# EAGLE design iot_env_mote (EAGLE 7.0.0)

## Sheet 1 of 2
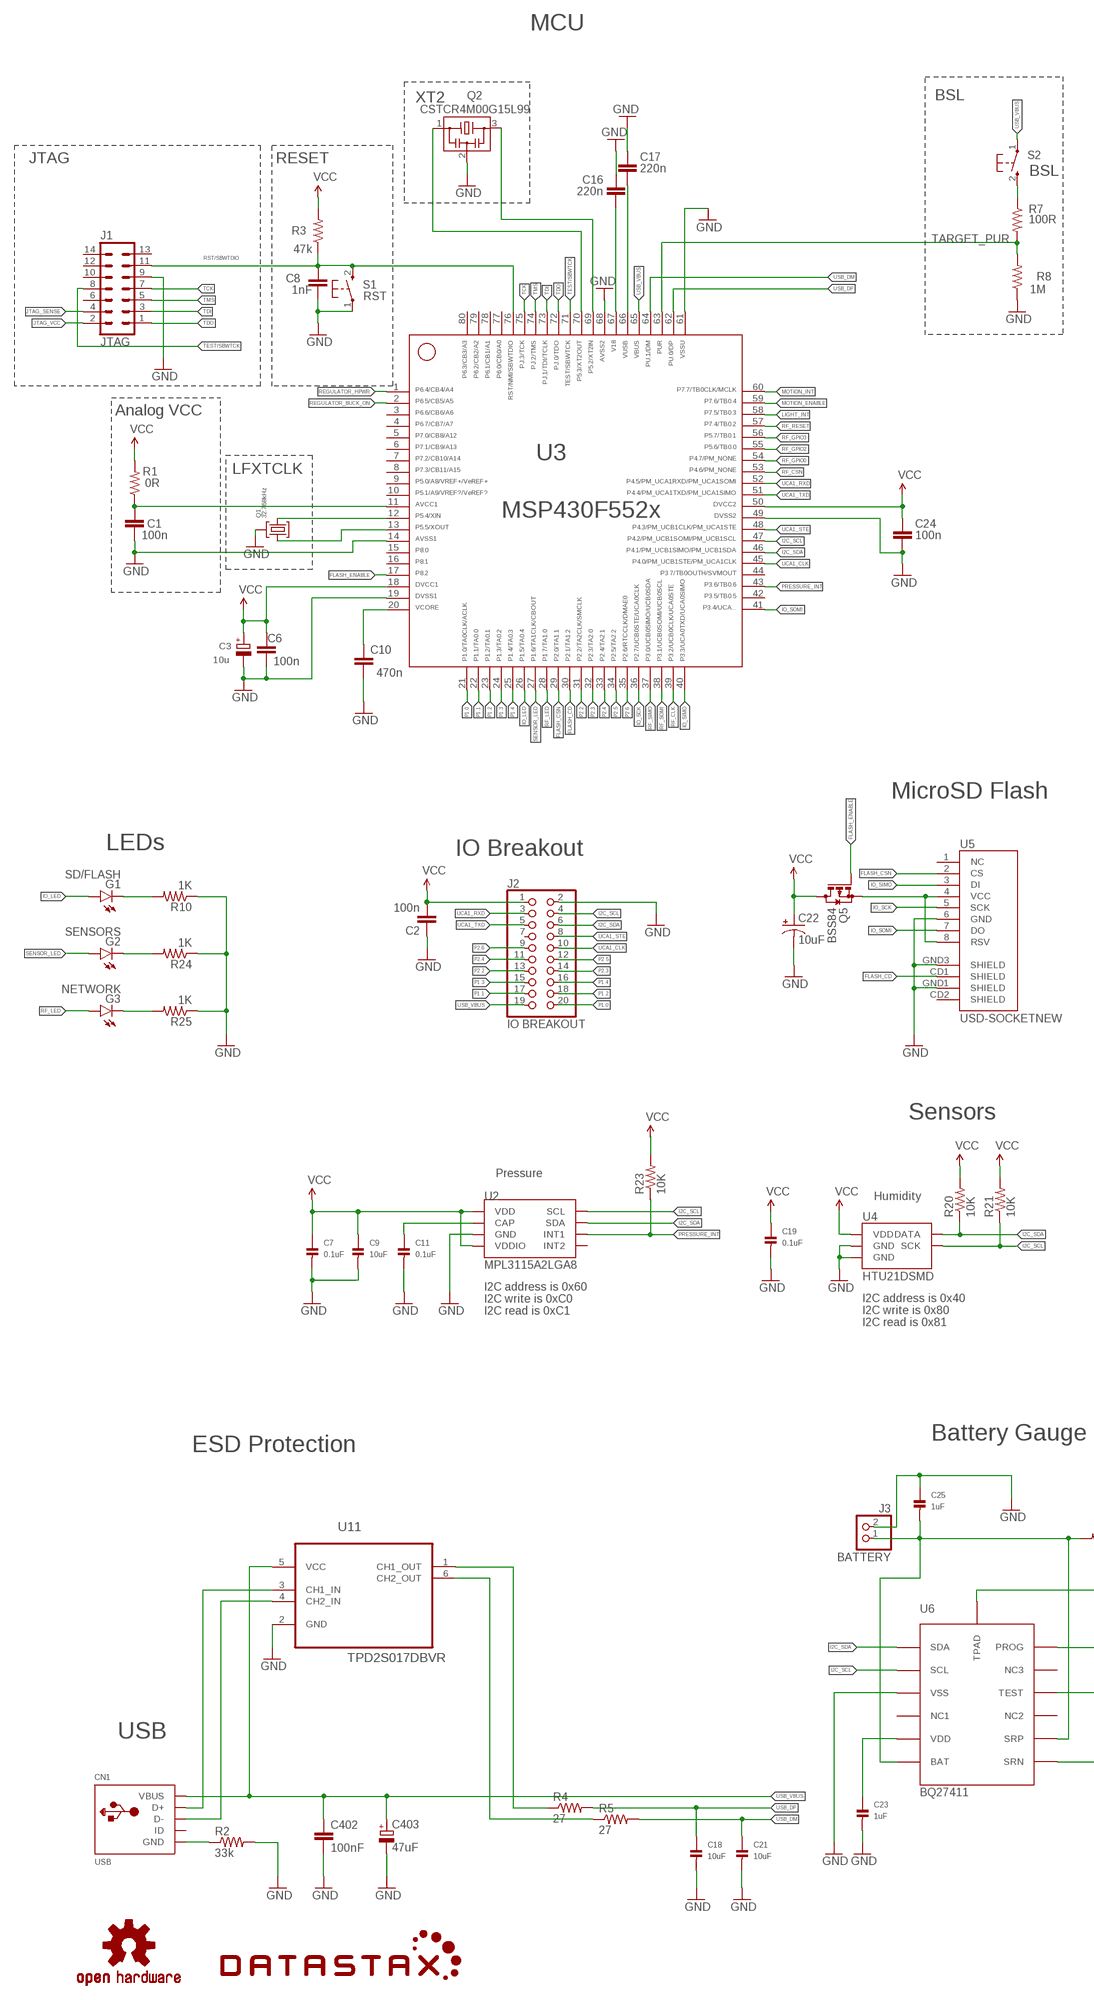
[diagram p0: schematic, sheet 1, part 1 of 2]
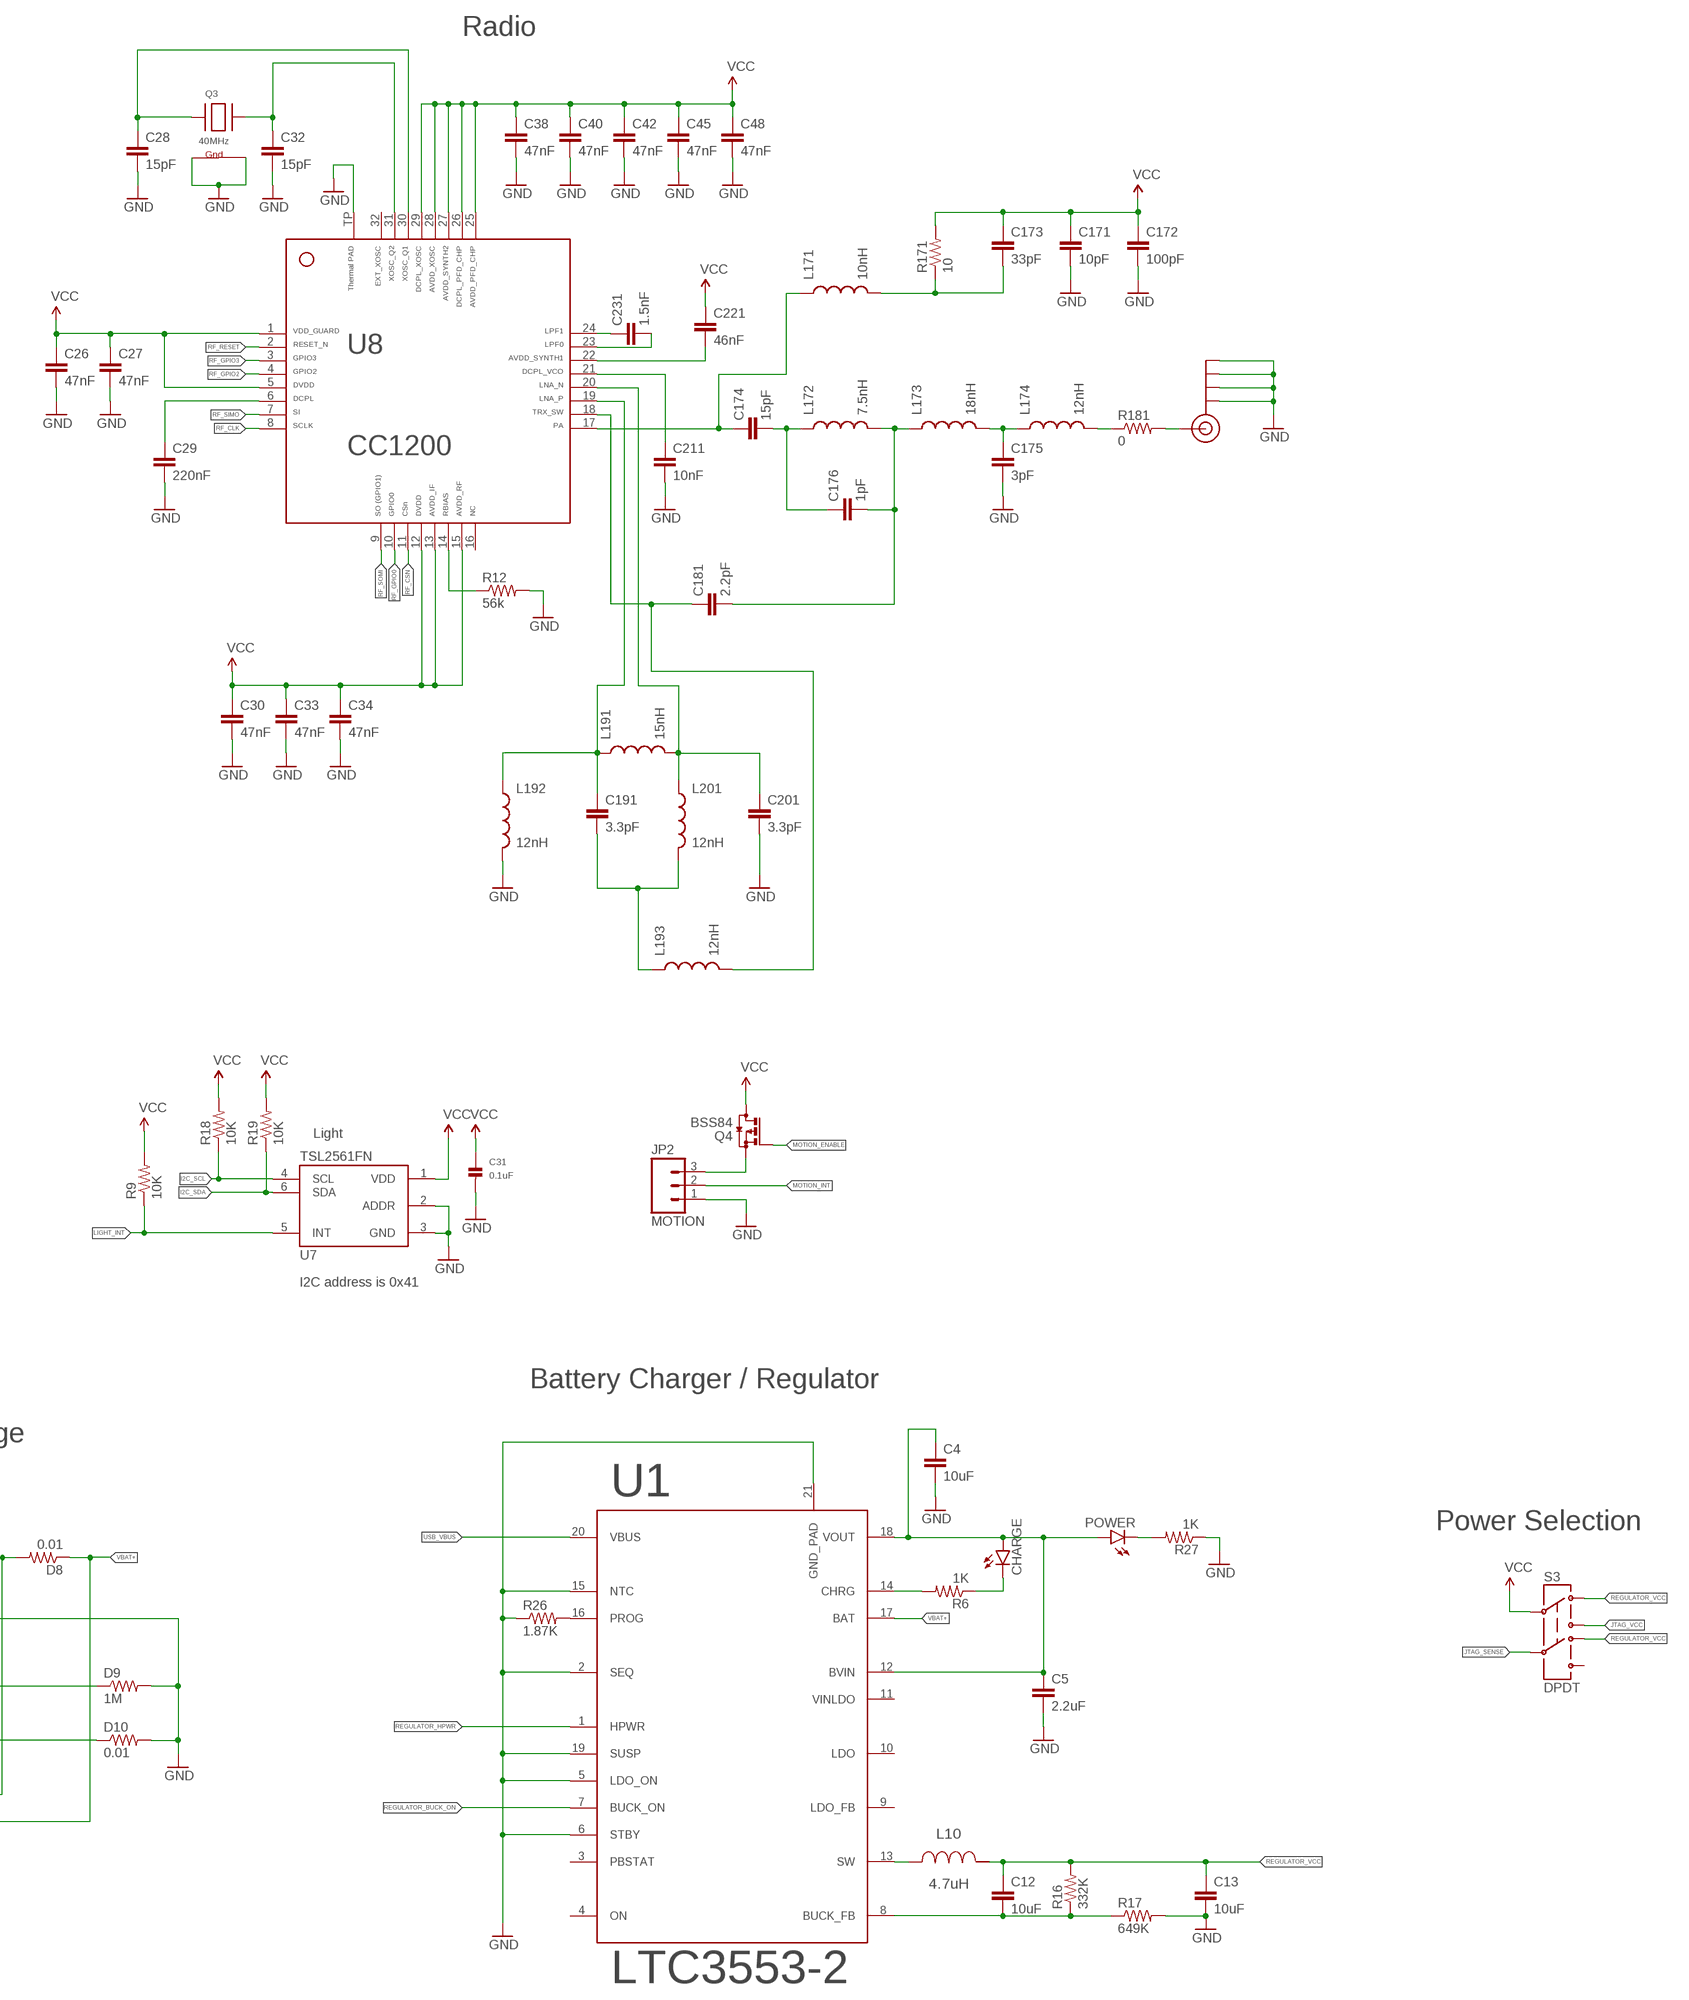
[diagram p1: schematic, sheet 1, part 2 of 2]

### Parts
C1  100n  C-EUC0402  [C0402]
C2  100n  C-EUC0402  [C0402]
C3  10u  CPOL-EUA/3216-18R  [A/3216-18R]
C4  10uF  CAP0805  [0805]
C5  2.2uF  CAP0805  [0805]
C6  100n  C-EUC0402  [C0402]
C7  0.1uF  CAP_CERAMIC0603  [0603]
C8  1nF  C-EUC0402  [C0402]
C9  10uF  CAP_CERAMIC0603  [0603]
C10  470n  C-EUC0402  [C0402]
C11  0.1uF  CAP_CERAMIC0603  [0603]
C12  10uF  CAP0805  [0805]
C13  10uF  CAP0805  [0805]
C16  220n  C-EUC0402  [C0402]
C17  220n  C-EUC0402  [C0402]
C18  10uF  CAP_CERAMIC0603  [0603]
C19  0.1uF  CAP_CERAMIC0603  [0603]
C21  10uF  CAP_CERAMIC0603  [0603]
C22  10uF  CPOL-USA/3216-18R  [A/3216-18R]
C23  1uF  CAP_CERAMIC0603  [0603]
C24  100n  C-EUC0402  [C0402]
C25  1uF  CAP_CERAMIC0603  [0603]
C26  47nF  CAP0402-CAP  [0402-CAP]
C27  47nF  CAP0402-CAP  [0402-CAP]
C28  15pF  CAP0402-CAP  [0402-CAP]
C29  220nF  CAP0402-CAP  [0402-CAP]
C30  47nF  CAP0402-CAP  [0402-CAP]
C31  0.1uF  CAP_CERAMIC0603  [0603]
C32  15pF  CAP0402-CAP  [0402-CAP]
C33  47nF  CAP0402-CAP  [0402-CAP]
C34  47nF  CAP0402-CAP  [0402-CAP]
C38  47nF  CAP0402-CAP  [0402-CAP]
C40  47nF  CAP0402-CAP  [0402-CAP]
C42  47nF  CAP0402-CAP  [0402-CAP]
C45  47nF  CAP0402-CAP  [0402-CAP]
C48  47nF  CAP0402-CAP  [0402-CAP]
C171  10pF  CAP0402-CAP  [0402-CAP]
C172  100pF  CAP0402-CAP  [0402-CAP]
C173  33pF  CAP0402-CAP  [0402-CAP]
C174  15pF  CAP0402-CAP  [0402-CAP]
C175  3pF  CAP0402-CAP  [0402-CAP]
C176  1pF  CAP0402-CAP  [0402-CAP]
C181  2.2pF  CAP0402-CAP  [0402-CAP]
C191  3.3pF  CAP0402-CAP  [0402-CAP]
C201  3.3pF  CAP0402-CAP  [0402-CAP]
C211  10nF  CAP0402-CAP  [0402-CAP]
C221  46nF  CAP0402-CAP  [0402-CAP]
C231  1.5nF  CAP0402-CAP  [0402-CAP]
C402  100nF  C-EUC0402  [C0402]
C403  47uF  CPOL-EUA/3216-18R  [A/3216-18R]
CHARGE  LED0603  [LED-0603]
CN1  USB  USBMINIB  [USB-MINIB]
D8  0.01  R-US_R0402  [R0402]
D9  1M  R-US_R0402  [R0402]
D10  0.01  R-US_R0402  [R0402]
G1  SD/FLASH  LED0603  [LED-0603]
G2  SENSORS  LED0603  [LED-0603]
G3  NETWORK  LED0603  [LED-0603]
J1  JTAG  ML14  [ML14]
J2  IO BREAKOUT  PINHD-2X10  [2X10]
J3  BATTERY  JST_2PIN-SMT-RA  [JST-PH-2-SMT-RA]
JP2  MOTION  M03JST-PTH-VERT  [JST-3-PTH-VERT]
L10  4.7uH  SDR0403-2R2MLSDR0403-2R2ML  [SDR0403]
L171  10nH  INDUCTOR0402  [C0402]
L172  7.5nH  INDUCTOR0402  [C0402]
L173  18nH  INDUCTOR0402  [C0402]
L174  12nH  INDUCTOR0402  [C0402]
L191  15nH  INDUCTOR0402  [C0402]
L192  12nH  INDUCTOR0402  [C0402]
L193  12nH  INDUCTOR0402  [C0402]
L201  12nH  INDUCTOR0402  [C0402]
LOGO1  OSHW-LOGOL  [OSHW-LOGO-L]
POWER  LED0603  [LED-0603]
Q1  32.768kHz  MS3V-T1R  [MS3V-T1R]
Q2  CSTCR4M00G15L99  MURATA-FILTER_CSTCR6M00G53Z  [MURATA-FILTER_CSTCR]
Q3  40MHz  XTAL-4-3225  [NX3225]
Q4  BSS84  [SOT23]
Q5  BSS84  [SOT23]
R1  0R  R-US_R0402  [R0402]
R2  33k  RESISTOR0402-RES  [0402-RES]
R3  47k  R-US_R0402  [R0402]
R4  27  RESISTOR0402-RES  [0402-RES]
R5  27  RESISTOR0402-RES  [0402-RES]
R6  1K  R-US_R0402  [R0402]
R7  100R  R-US_R0402  [R0402]
R8  1M  R-US_R0402  [R0402]
R9  10K  R-US_R0402  [R0402]
R10  1K  RESISTOR0402-RES  [0402-RES]
R12  56k  RESISTOR0402-RES  [0402-RES]
R16  332K  R-US_R0402  [R0402]
R17  649K  R-US_R0402  [R0402]
R18  10K  R-US_R0402  [R0402]
R19  10K  R-US_R0402  [R0402]
R20  10K  R-US_R0402  [R0402]
R21  10K  R-US_R0402  [R0402]
R23  10K  R-US_R0402  [R0402]
R24  1K  RESISTOR0402-RES  [0402-RES]
R25  1K  RESISTOR0402-RES  [0402-RES]
R26  1.87K  R-US_R0402  [R0402]
R27  1K  R-US_R0402  [R0402]
R171  10  RESISTOR0402-RES  [0402-RES]
R181  0  RESISTOR0402-RES  [0402-RES]
S1  RST  PB  [PBTH]
S2  BSL  PB  [PBTH]
S3  DPDT  SWITCH-DPDTAYZ0202  [AYZ0202]
SMA  SMA_EDGE  [SMA-EDGE]
U1  LTC3553-2  [QFN-20-0.4MM]
U2  MPL3115A2LGA8  [LGA8]
U3  MSP430F5529IPNR  F552X---PN80  [PN80]
U4  HTU21DSMD  [HTU21D]
U5  USD-SOCKETNEW  [MICRO-SD-SOCKET-PP]
U6  BQ27411  [VSON40P400X400X12]
U7  TSL2561FN  [FN-6]
U8  CC1200  [RHB32]
U11  TPD2S017DBVR  [SOT95P280X145-6N]
U$1  DATASTAX_LOGO  [DATASTAX_LOGO]

### Nets
AVCC [Power]: C1.1 R1.1 U3.11
BQ27411_BAT [Power]: C25.2 D8.2 J3.1 U6.BAT U6.SRP
FLASH_CD: U3.30 U5.CD1(SHIELD)
FLASH_CSN: U3.29 U5.2(CS)
FLASH_ENABLE: Q5.1(G) U3.17
GND [Ground]: C1.2 C2.1 C3.- C4.2 C5.2 C6.1 C7.2 C8.2 C9.2 C10.1 C11.2 C13.2 C16.2 C17.2 C18.2 C19.2 C21.2 C22.- C23.2 C24.2 C25.1 C26.2 C27.2 C28.2 C29.2 C30.2 C31.2 C32.2 C33.2 C34.2 C38.2 C40.2 C42.2 C45.2 C48.2 C171.2 C172.2 C175.2 C201.2 C211.2 C402.2 C403.- D9.2 D10.2 J1.9 J2.2 J3.2 JP2.1 L192.2 Q1.P3(GND) Q2.2 Q3.2(G2) Q3.4(G1) R2.2 R8.1 R10.1 R12.2 R17.2 R24.1 R25.1 R26.1 R27.1 S1.1(P) SMA.GND@0(GND) SMA.GND@1(GND) SMA.GND@2(GND) SMA.GND@3(GND) U1.2(SEQ) U1.5(LDO_ON) U1.6(STBY) U1.15(NTC) U1.19(SUSP) U1.21(GND_PAD) U2.3(GND) U3.14 U3.19 U3.49 U3.61 U3.68 U4.7(GND) U4.GND U5.6(GND) U5.GND1(SHIELD) U5.GND3(SHIELD) U6.GND(TPAD) U6.VSS U7.2(ADDR) U7.3(GND) U8.TP U11.2(GND)
I2C_SCL: J2.4 R18.1 R21.1 U2.8(SCL) U3.47 U4.SCK U6.SCL U7.4(SCL)
I2C_SDA: J2.6 R19.1 R20.1 U2.7(SDA) U3.46 U4.DATA U6.SDA U7.6(SDA)
IO_LED: G1.A U3.26
IO_SCK: U3.36 U5.5(SCK)
IO_SIMO: U3.40 U5.3(DI)
IO_SOMI: U3.41 U5.7(DO)
JTAG_SENSE: J1.4 S3.5
JTAG_VCC: J1.2 S3.3
LIGHT_INT: R9.1 U3.58 U7.5(INT)
MOTION_ENABLE: Q4.1(G) U3.59
MOTION_INT: JP2.2 U3.60
N$1: C11.1 U2.2(CAP)
N$3 [Power]: JP2.3 Q4.2(S)
N$4: C174.1 L171.1 U8.17
N$7 [Power]: Q5.2(S) U5.4(VCC) U5.8(RSV)
N$9: C231.2 U8.23
N$10: CN1.D+ U11.3(CH1_IN)
N$11: C23.1 U6.VDD
N$12: D10.1 U6.TEST
N$13: C231.1 U8.24
N$14: CN1.D- U11.4(CH2_IN)
N$15: D9.1 U6.PROG
N$16: C211.1 U8.21
N$17: C174.2 C176.1 L172.1
N$18: C29.1 U8.6
N$20: C176.2 C181.2 L172.2 L173.1
N$22: L174.2 R181.1
N$23: C181.1 L193.2 U8.18
N$24: C221.2 U8.22
N$25: R181.2 SMA.SIG(SIGNAL)
N$26: C175.1 L173.2 L174.1
N$27 [Ground]: CN1.GND R2.1
N$28: C173.2 L171.2 R171.1
N$30: C28.1 Q3.1(X1) U8.30
N$31: C191.1 L191.1 L192.1 U8.19
N$32: C201.1 L191.2 L201.1 U8.20
N$33: C32.1 Q3.3(X2) U8.31
N$34: G1.C R10.2
N$35: C191.2 L193.1 L201.2
N$36: L10.2 U1.13(SW)
N$37: R12.1 U8.14
N$38: R7.1 S2.2(S)
N$39: G2.C R24.2
N$41: G3.C R25.2
N$42: R5.1 U11.6(CH2_OUT)
N$43: R4.1 U11.1(CH1_OUT)
N$44: CHARGE.C R6.1
N$45: C4.1 C5.1 CHARGE.A POWER.A U1.12(BVIN) U1.18(VOUT)
N$46: R6.2 U1.14(CHRG)
N$47: POWER.C R27.2
N$49: C12.2 R16.1 R17.1 U1.8(BUCK_FB)
N$50: R26.2 U1.16(PROG)
P1.0: J2.20 U3.21
P1.1: J2.17 U3.22
P1.2: J2.18 U3.23
P1.3: J2.15 U3.24
P1.4: J2.16 U3.25
P2.2: J2.13 U3.31
P2.3: J2.14 U3.32
P2.4: J2.11 U3.33
P2.5: J2.12 U3.34
P2.6: J2.9 U3.35
P5.2/XT2IN: Q2.3 U3.69
P5.3/XT2OUT: Q2.1 U3.70
P5.4/XIN: Q1.P2 U3.12
P5.5/XOUT: Q1.P1 U3.13
PRESSURE_INT: R23.1 U2.6(INT1) U3.43
REGULATOR_BUCK_ON: U1.7(BUCK_ON) U3.2
REGULATOR_HPWR: U1.1(HPWR) U3.1
REGULATOR_VCC: C12.1 C13.1 L10.1 R16.2 S3.1 S3.4
RF_CLK: U3.39 U8.8
RF_CSN: U3.53 U8.11
RF_GPIO0: U3.54 U8.10
RF_GPIO2: U3.55 U8.4
RF_GPIO3: U3.56 U8.3
RF_LED: G3.A U3.28
RF_RESET: U3.57 U8.2
RF_SIMO: U3.37 U8.7
RF_SOMI: U3.38 U8.9
RST/SBWTDIO: C8.1 J1.11 R3.1 S1.2(S) U3.76
SENSOR_LED: G2.A U3.27
TARGET_PUR: R7.2 R8.2 U3.63
TARGET_VUSB [Power]: C17.1 U3.66
TCK: J1.7 U3.75
TDI: J1.3 U3.73
TDO: J1.1 U3.72
TEST/SBWTCK: J1.8 U3.71
TMS: J1.5 U3.74
UCA1_CLK: J2.10 U3.45
UCA1_RXD: J2.3 U3.52
UCA1_STE: J2.8 U3.48
UCA1_TXD: J2.5 U3.51
USB_DM: C21.1 R5.2 U3.64
USB_DP: C18.1 R4.2 U3.62
USB_VBUS: C402.1 C403.+ CN1.VBUS J2.19 S2.1(P) U1.20(VBUS) U3.65 U11.5(VCC)
V18 [Power]: C16.1 U3.67
VBAT+: D8.1 U1.17(BAT) U6.SRN
VCC [Power]: C2.2 C3.+ C6.2 C7.1 C9.1 C19.1 C22.+ C24.1 C26.1 C27.1 C30.1 C31.1 C33.1 C34.1 C38.1 C40.1 C42.1 C45.1 C48.1 C171.1 C172.1 C173.1 C221.1 J2.1 Q4.3(D) Q5.3(D) R1.2 R3.2 R9.2 R18.2 R19.2 R20.2 R21.2 R23.2 R171.2 S3.2 U2.1(VDD) U2.4(VDDIO) U3.18 U3.50 U4.VDD U7.1(VDD) U8.1 U8.5 U8.12 U8.13 U8.15 U8.25 U8.26 U8.27 U8.28 U8.29
VCORE [Power]: C10.2 U3.20
Unconnected: CN1.ID J1.6 J1.10 J1.12 J1.13 J1.14 J2.7 S3.6 U1.3(PBSTAT) U1.4(ON) U2.5(INT2) U3.3 U3.4 U3.5 U3.6 U3.7 U3.8 U3.9 U3.10 U3.15 U3.16 U3.42 U3.44 U3.77 U3.78 U3.79 U3.80 U5.1(NC) U5.CD2(SHIELD) U6.NC1 U6.NC2(NC3) U6.NC3(NC2) U8.16 U8.32

### Notes on the sheet
- MCU
- XT2 | BSL
- JTAG | RESET
- Radio
- Analog VCC
- /Users/mstump/Downloads/datastax_logo_black.bmp
- LFXTCLK
- MicroSD Flash
- LEDs | IO Breakout
- Sensors
- Pressure
- Light
- Humidity
- I2C address is 0x41
- I2C address is 0x60
  I2C write is 0xC0
  I2C read is 0xC1
- I2C address is 0x40
  I2C write is 0x80
  I2C read is 0x81
- Battery Charger / Regulator
- Battery Gauge
- ESD Protection
- Power Selection
- USB

## Sheet 2 of 2

## Power pins joined to a net without a drawn wire
LDO: U1.10(LDO)
LDO_FB: U1.9(LDO_FB)
VINLDO: U1.11(VINLDO)

## Library data of the parts
C1 C2 C6 C8 C10 C16 C17 C24 C402 = rcl:C-EU: CAPACITOR, European symbol
C3 C403 = rcl:CPOL-EU: POLARIZED CAPACITOR, European symbol
C4 C5 C12 C13 = SparkFun-Capacitors:CAP: Capacitor Standard 0603 ceramic capacitor, and 0.1" leaded capacitor.; MPN: 06035A100FAT2A; OC_NEWARK: 43T7237
C7 C11 C19 C31 = microbuilder:CAP_CERAMIC: Ceramic Capacitors 0402 - 0402 Surface Mount Capacitors 16pF 50V 5% [Digikey: 445-4899-2-ND] 18pF 50V 5% [Digikey: 490-1281-2-ND] 22pF 50V 5% [Digikey: 490-1283-2-ND] 68pF 50V 5% [Digikey: 490-1289-2-ND] 0.1uF 10V 10% [Digikey: 490-1318-2-ND] 1.0uF 6.3V 10% [Digikey: 490-1320-2-ND] 0603 - 0603 Surface Mount Capacitors 16 pF 50V 5% [Digikey: 445-5051-2-ND] 22 pF 50V [Digikey: PCC220ACVTR-ND] 33 pF 50V 5% [Digikey: 490-1415-1-ND] 56pF 50V 5% [Digikey: 490-1421-1-ND] 220pF 50V 5% [Digikey: 445-1285-1-ND] 680 pF 50V 2200 pF 50V 5% C0G [Digikey: 445-1297-1-ND] 5600 pF 100V 5% X7R [Digikey: 478-3711-1-ND] 0.1 µF 25V 10% [Digikey: PCC2277TR-ND] 0.22 µF 16V 10% X7R [Digikey: 445-1318-1-ND] 1.0 µF 25V 10% [Digikey: 445-5146-2-ND] 0603 - RF Specific 3pF 250V +/-0.1pF RF [Digikey: 712-1347-1-ND] 18 pF 250V 5% [Digikey: 478-3505-1-ND or 712-1322-1-ND] 56 pF 250V 5% C0G RF [Digikey: 490-4867-1-ND] 68 pF 250V RF [Digikey: 490-4868-1-ND] 0805 - 0805 Surface Mount Capacitors 220 pF 250V 2% RF Ceramic Capacitor [Digikey: 712-1398-1-ND] 1000 pF 50V 2% NP0 Ceramic Capacitor [Digikey: 478-3760-1-ND] 0.1 µF 25V 10% Ceramic Capacitor [Digikey: PCC1828TR-ND] 1.0 µF 16V 10% Ceramic Capacitor[Digikey: 490-1691-2-ND] 10.0 µF 10V 10% Ceramic Capacitor[Digikey: 709-1228-1-ND] 10.0 uF 16V 10% Ceramic Capacitor [Digikey: 478-5165-2-ND] 47 uF 6.3V 20% Ceramic Capacitor [Digikey: 587-1779-1-ND or 399-5506-1-ND] 1206 - 1206 Surface Mount Capacitors 47uF 10V 20% Ceramic Capacitor [Digikey: 490-5528-1-ND or 399-5508-1-ND or 445-6010-1-ND] 100uF 6.3V -20%, +80% Y5V Ceramic Capacitor (Digikey: 490-4512-1-ND, Mouser: 81-GRM31CF50J107ZE1L); MPN: 0603YC104JAT2A; OC_NEWARK: 96M1175
C9 C18 C21 C23 C25 = microbuilder:CAP_CERAMIC: Ceramic Capacitors 0402 - 0402 Surface Mount Capacitors 16pF 50V 5% [Digikey: 445-4899-2-ND] 18pF 50V 5% [Digikey: 490-1281-2-ND] 22pF 50V 5% [Digikey: 490-1283-2-ND] 68pF 50V 5% [Digikey: 490-1289-2-ND] 0.1uF 10V 10% [Digikey: 490-1318-2-ND] 1.0uF 6.3V 10% [Digikey: 490-1320-2-ND] 0603 - 0603 Surface Mount Capacitors 16 pF 50V 5% [Digikey: 445-5051-2-ND] 22 pF 50V [Digikey: PCC220ACVTR-ND] 33 pF 50V 5% [Digikey: 490-1415-1-ND] 56pF 50V 5% [Digikey: 490-1421-1-ND] 220pF 50V 5% [Digikey: 445-1285-1-ND] 680 pF 50V 2200 pF 50V 5% C0G [Digikey: 445-1297-1-ND] 5600 pF 100V 5% X7R [Digikey: 478-3711-1-ND] 0.1 µF 25V 10% [Digikey: PCC2277TR-ND] 0.22 µF 16V 10% X7R [Digikey: 445-1318-1-ND] 1.0 µF 25V 10% [Digikey: 445-5146-2-ND] 0603 - RF Specific 3pF 250V +/-0.1pF RF [Digikey: 712-1347-1-ND] 18 pF 250V 5% [Digikey: 478-3505-1-ND or 712-1322-1-ND] 56 pF 250V 5% C0G RF [Digikey: 490-4867-1-ND] 68 pF 250V RF [Digikey: 490-4868-1-ND] 0805 - 0805 Surface Mount Capacitors 220 pF 250V 2% RF Ceramic Capacitor [Digikey: 712-1398-1-ND] 1000 pF 50V 2% NP0 Ceramic Capacitor [Digikey: 478-3760-1-ND] 0.1 µF 25V 10% Ceramic Capacitor [Digikey: PCC1828TR-ND] 1.0 µF 16V 10% Ceramic Capacitor[Digikey: 490-1691-2-ND] 10.0 µF 10V 10% Ceramic Capacitor[Digikey: 709-1228-1-ND] 10.0 uF 16V 10% Ceramic Capacitor [Digikey: 478-5165-2-ND] 47 uF 6.3V 20% Ceramic Capacitor [Digikey: 587-1779-1-ND or 399-5506-1-ND] 1206 - 1206 Surface Mount Capacitors 47uF 10V 20% Ceramic Capacitor [Digikey: 490-5528-1-ND or 399-5508-1-ND or 445-6010-1-ND] 100uF 6.3V -20%, +80% Y5V Ceramic Capacitor (Digikey: 490-4512-1-ND, Mouser: 81-GRM31CF50J107ZE1L); MPN: 06035A100FAT2A; OC_NEWARK: 43T7237
C22 = adafruit:CPOL-US: POLARIZED CAPACITOR, American symbol
C26-C30 C32-C34 C38 C40 C42 C45 C48 C171-C176 C181 C191 C201 C211 C221 C231 = SparkFun-Capacitors:CAP: Capacitor Standard 0603 ceramic capacitor, and 0.1" leaded capacitor.; MPN: 0603YC104JAT2A; OC_NEWARK: 96M1175
CHARGE G1-G3 POWER = SparkFun-LED:LED: LEDs Standard schematic elements and footprints for 5mm, 3mm, 1206, and 0603 sized LEDs. 5mm - Spark Fun Electronics SKU : COM-00529 (and others)
CN1 = adafruit:USB: USB Connectors USBMINIB - Surface Mount Female Mini-B USB Connector 4UConnector: 06564 By microbuilder.eu Thru-hole RA Female Mini-B USB Connector 4UConnector: 18732 By ladyada.net
D8-D10 R1 R3 R6-R8 R16 R17 R26 R27 = adafruit:R-US_: RESISTOR, American symbol
J1 = CON-ML:ML14: HARTING; OC_FARNELL: unknown; OC_NEWARK: unknown
J2 = pinhead:PINHD-2X10: PIN HEADER
J3 = adafruit:JST_2PIN: JST 2-Pin Connectors of various flavors SMT-RA (S2B-PH-SM4) 4UConnector #17311 SMT (B2B-PH-SM4) THM-RA (S2B-PH) THM (B2B-PH)
JP2 = SparkFun-Connectors:M03: Header 3 Standard 3-pin 0.1" header. Use with straight break away headers (SKU : PRT-00116), right angle break away headers (PRT-00553), swiss pins (PRT-00743), machine pins (PRT-00117), and female headers (PRT-00115). Molex polarized connector foot print use with SKU : PRT-08232 with associated crimp pins and housings.
L10 = AcceleratedDesigns_Lib:SDR0403-2R2ML; DCR: 0.047; IDC: 2.6; L: 2.2E-6; MANUFACTURER_NAME: Bourns; MANUFACTURER_PART_NUMBER: SDR0403-2R2ML; VENDOR: Bourns
L171-L174 L191-L193 L201 = SparkFun-Passives:INDUCTOR: Inductors Basic Inductor/Choke - 0603 and 1206. Footprints are not proven and vary greatly between part numbers. SRN6045- 33uH, 20% 1.4A SDR0403-560KL - 56uH, 10%, 500mA RMS/740mA peak
LOGO1 = SparkFun-Aesthetics:OSHW-LOGO: Open Source Hardware Logo This logo indicates the piece of hardware it is found on incorporates a OSHW license and/or adheres to the definition of open source hardware found here: http://freedomdefined.org/OSHW; OC_NEWARK: unknown
Q1 = microcrystal:MS3V-T1R
Q2 = murata:MURATA-FILTER_CSTCR: Resonator Source: murata.co.jp; MPN: CSTCR6M00G53-R0; OC_FARNELL: 1170434; OC_NEWARK: 25M8759
Q3 = adafruit:XTAL-4: Classic 4-pin 3.2 x 2.5mm crystal
Q4 Q5 = transistor-small-signal:BSS84: P-CHANNEL MOS FET
R2 R4 R5 R10 R12 R24 R25 R171 R181 = SparkFun-Passives:RESISTOR: Resistor Basic schematic elements and footprints for 0603, 1206, and PTH resistors.
R9 R18-R21 R23 = adafruit:R-US_: RESISTOR, American symbol; MPN: ERJ-P03F1002V; OC_NEWARK: 32R9341
S1 S2 = electricalmeter:PB: OMRON SWITCH
S3 = SparkFun-Electromechanical:SWITCH-DPDT: DPDT Version of the COM-00597; PROD_ID: SWCH-08179
SMA = SparkFun-Connectors:SMA_EDGE: SMA Antenna Connector End launch SMA connector. The paste layer has been removed so that the connector can be hand soldered onto the board after reflow.
U1 = iot_demo_hardware:LTC3553-2
U2 = SparkFun-Sensors:MPL3115A2: Altimeter/Pressure Sensor, I2C, 1.95V-3.6V supply, 50 to 110kPa; MPN: MPL3115A2; OC_NEWARK: 48T4344
U3 = TI_MSP430_v16_intern:F552X---PN80: ***MSP430F552X***PN80 http://www.ti.com/lit/gpn/msp430f5529 Rev1.0 06/2010 For F552X where X is 1,5,7,9
U4 = SparkFun-Sensors:HTU21D; MPN: HTU21D; OC_NEWARK: 37X5938
U5 = SparkFun-Connectors:USD-SOCKET: microSD Socket Push-push type uSD socket. Schematic element and footprint production proven. Spark Fun Electronics SKU : PRT-00127. tDoc lines correctly indicate media card edge positions when inserting (unlocked, locked, depressed).
U6 = iot_demo_hardware:BQ27411
U7 = mike-temp:TSL2561: TSL2561 illumination sensor Approximates Human Eye Response Precisely Measures Illuminance Programmable Interrupt Function with User-Defined Upper and Lower Threshold 400 KHz I2C interface Programmable Analog Gain and Integration Time Supporting 1,000,000-to-1 Dynamic Range Automatically Rejects 50/60-Hz Lighting Ripple Low Active Power (0.75 mW Typical) with Power Down Mode RoHS Compliant The TSL2561 is a light-to-digital converter that transform light intensity to a digital signal output via I2C interface. The device combines one broadband photodiode (visible plus infrared) and one infrared-responding photodiode on a single CMOS integrated circuit capable of providing a near-photopic response over an effective 20-bit dynamic range (16-bit resolution). Two integrating ADCs convert the photodiode currents to a digital output that represents the irradiance measured on each channel. This digital output can be input to a microprocessor where illuminance (ambient light level) in lux is derived using an empirical formula to approximate the human eye response. The TSL2561 device supports a traditional level style interrupt that remains asserted until the firmware clears it.; MPN: TSL2561T; OC_NEWARK: 05M1632
U8 = iot_demo_hardware:CC1200: CC1200
U11 = Texas Instruments_By_element14_Batch_1:TPD2S017DBVR: 2-CHANNEL ULTRA-LOW CLAMP VOLTAGE ESD SOLUTION WITH SERIES-RESISTOR ISOLATION; MPN: TPD2S017DBVR; OC_FARNELL: -; OC_NEWARK: 50R8094; PACKAGE: SOT-23-6; SUPPLIER: Texas Instruments
U$1 = datastax:DATASTAX_LOGO

## Net classes
1 Ground: width 0.203 mm, drill 0.305 mm, clearance 0.152 mm to class 0, clearance 0.152 mm
2 Power: width 0.203 mm, drill 0.305 mm, clearance 0.152 mm to class 0, clearance 0.152 mm to class 1, clearance 0.152 mm

## Board
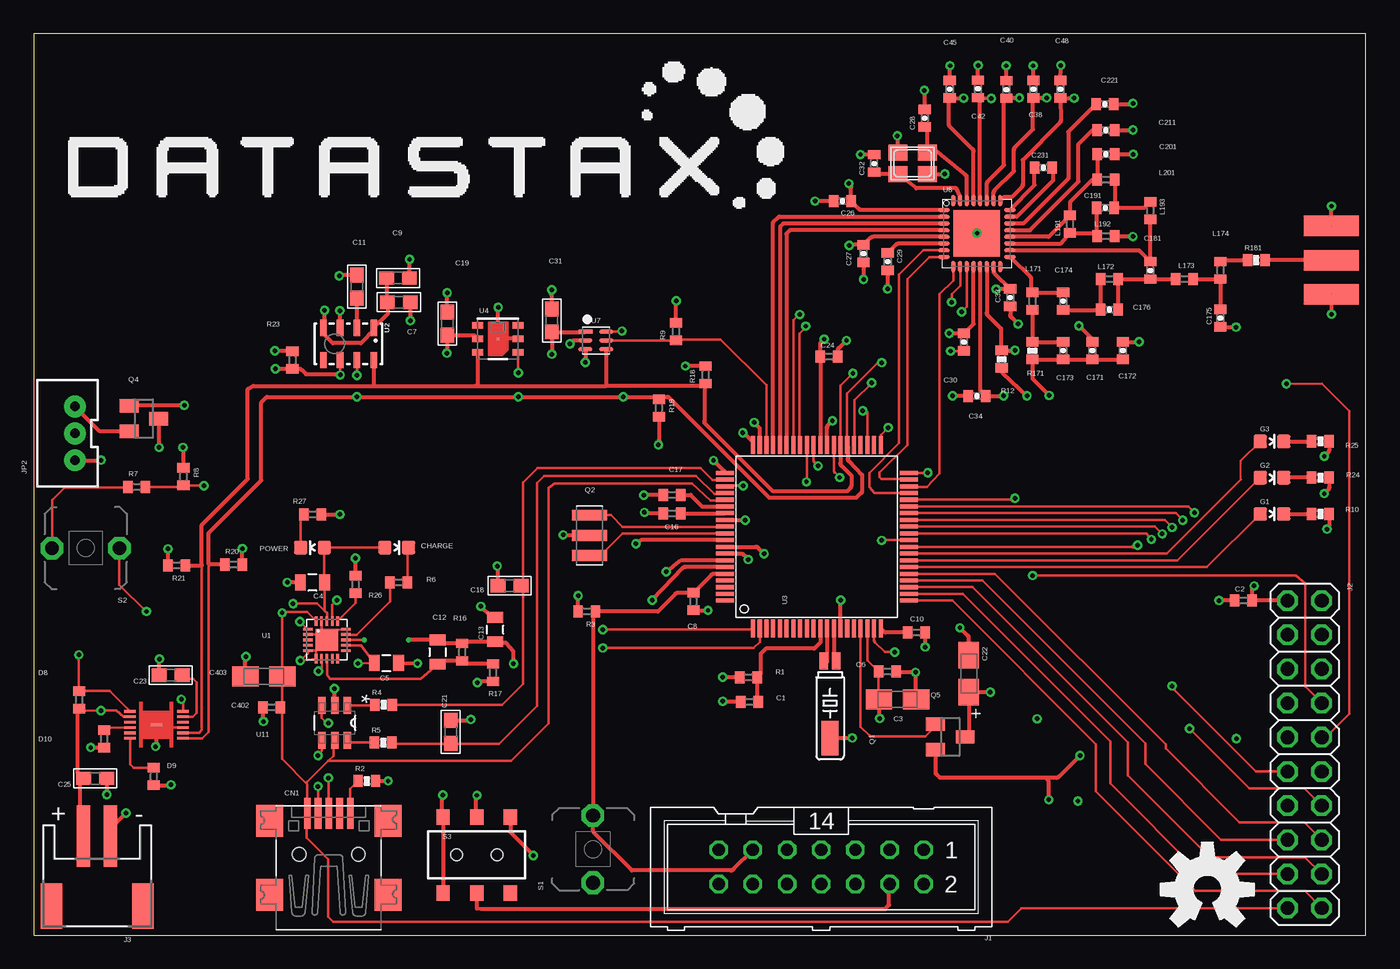
[diagram p2: board, top side]
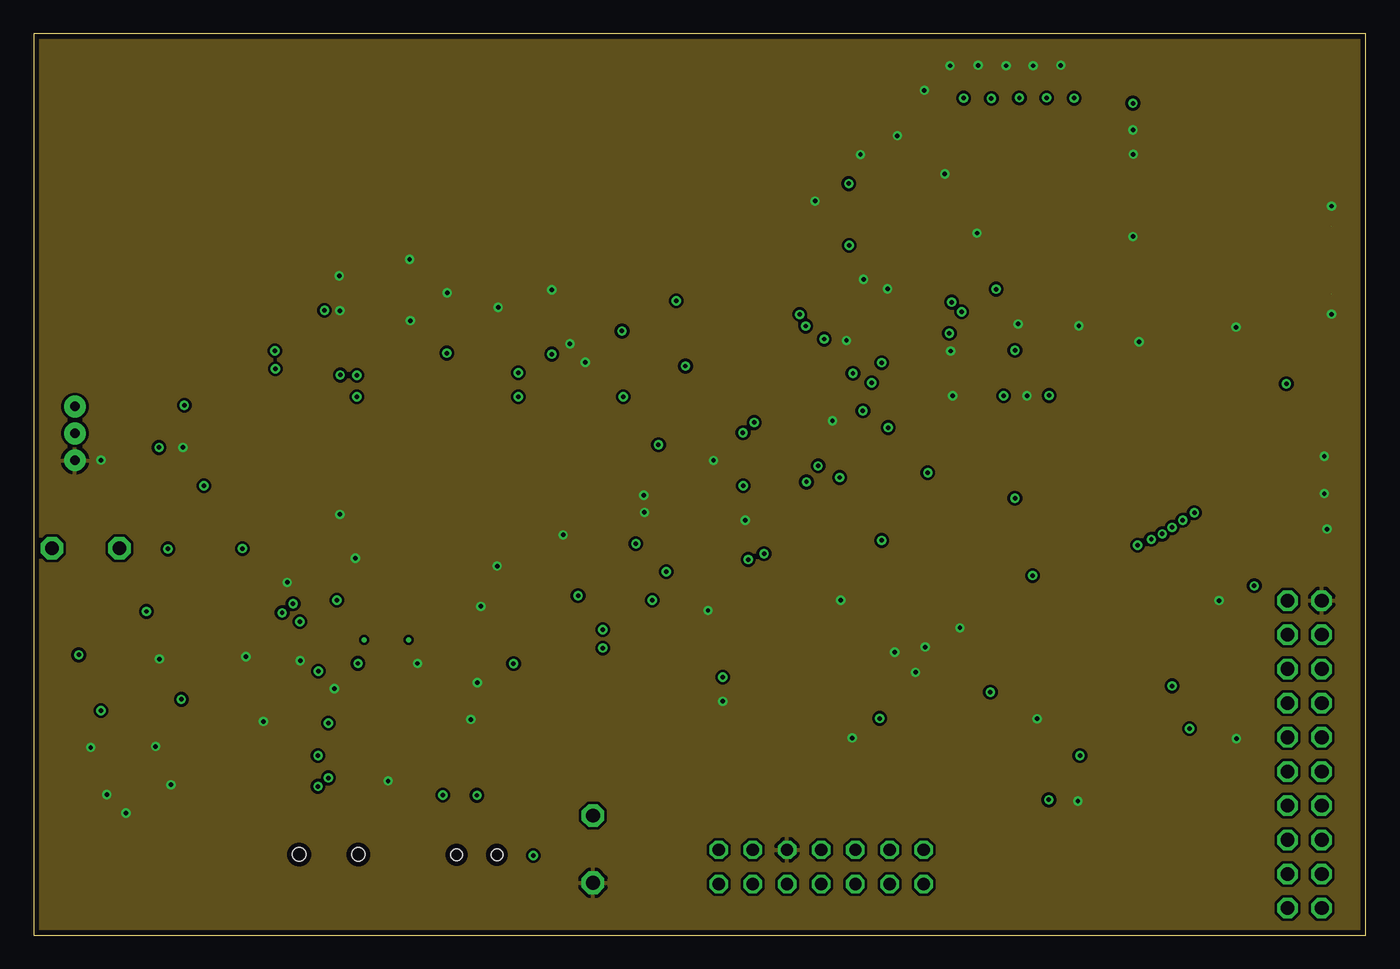
[diagram p3: board, inner layer Route2]
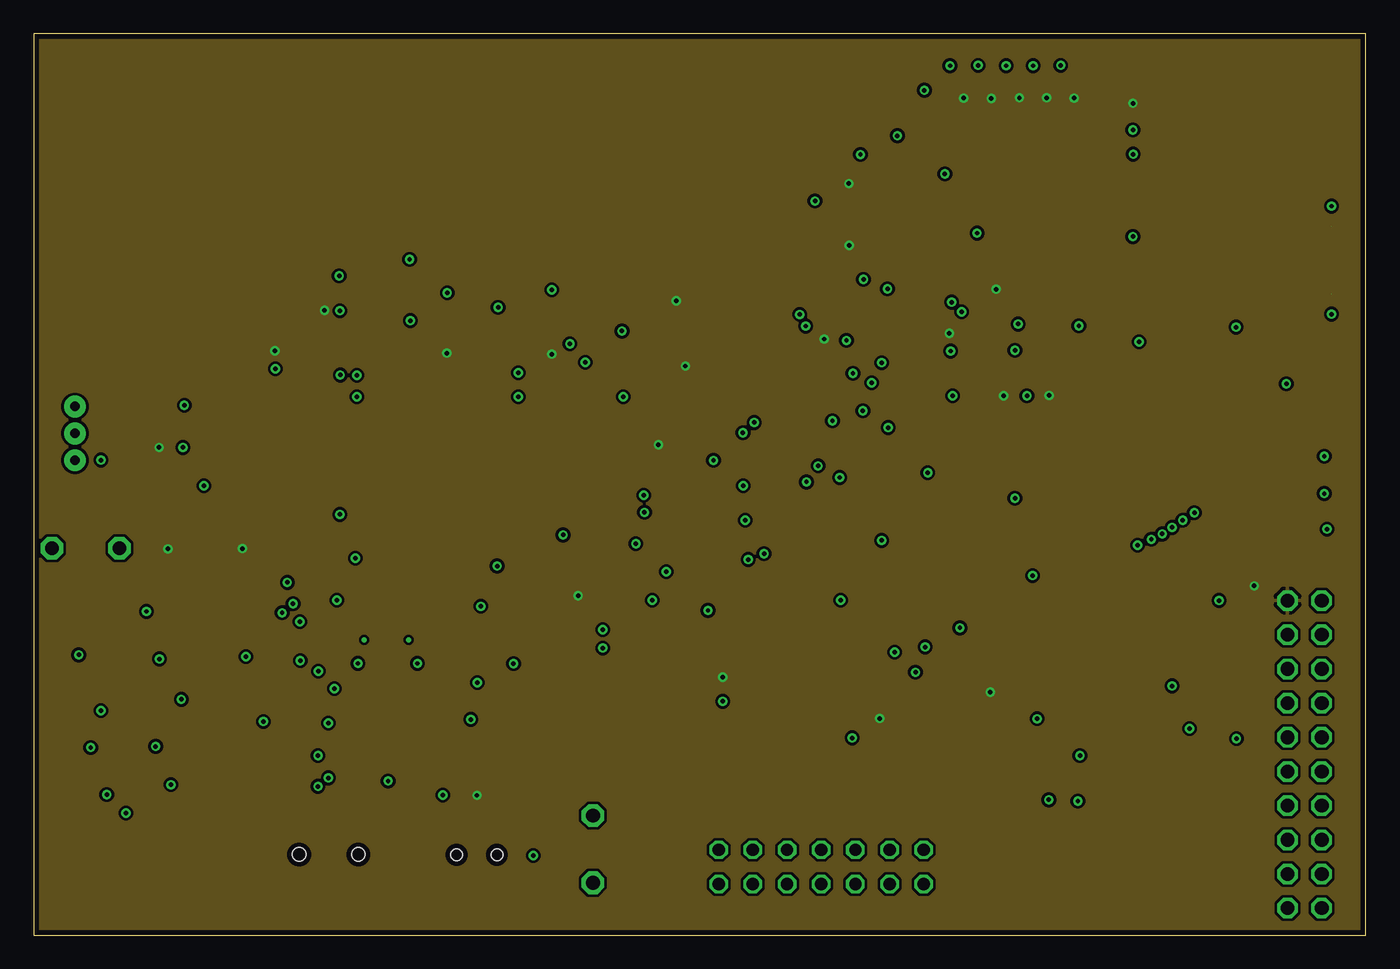
[diagram p4: board, inner layer Route15]
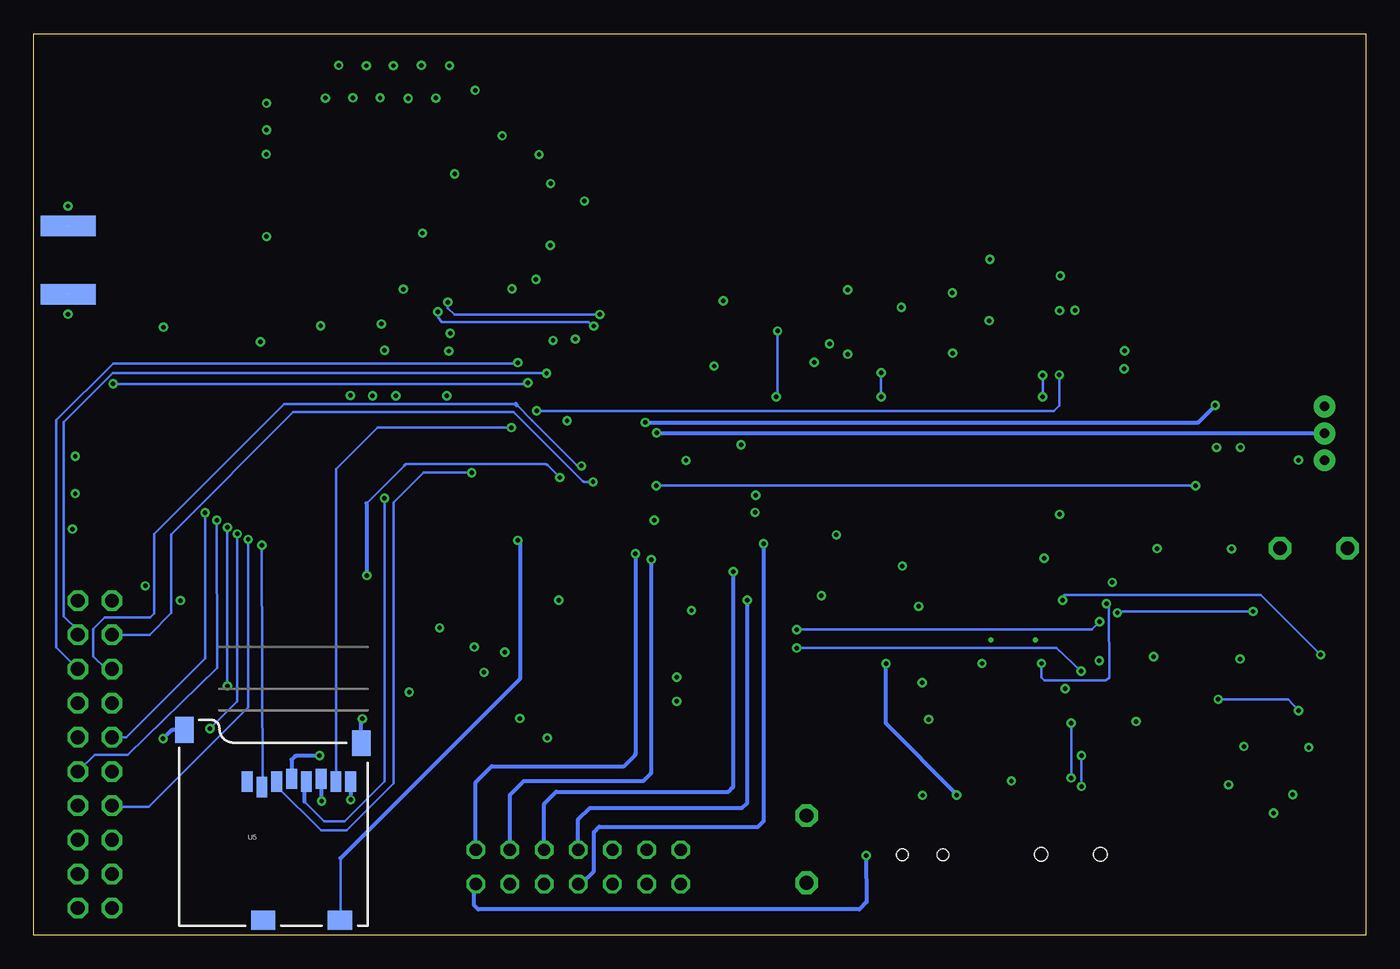
[diagram p5: board, bottom side, seen from below]

Size 99 x 67 mm. Coordinates in mm from the lower left corner, seen from the top.
Outline: 0.02,0 99,0 99,67 0,67 0.02,0
Copper layers (1*2+15*16): Top 0.0356mm / dielectric 1.5011mm / Route2 0.0356mm / dielectric 0.1499mm / Route15 0.0356mm / dielectric 0.2007mm / Bottom 0.0356mm
Design rules "LaenPCBOrder *": minimum track width 6mil, minimum drill 13mil, track to track 6mil, track to pad 6mil, pad to pad 6mil, via to via 6mil, smd to smd 6mil, copper to edge 15mil, drill to drill 6mil, minimum pad ring 7mil, minimum via ring 7mil, stop-mask expansion 3mil, vias tented up to drill 0mil, thermal gap 10mil

### Footprints (pad centres in the part's own frame; a part is rotated, then mirrored left to right if it is on the bottom)
C0402 = smd 0.7 x 0.9: 1 -0.65,0; 2 0.65,0
A/3216-18R = smd 1.95 x 1.5: + 1.375,0; - -1.375,0
0805 = smd 0.8 x 1.2: 1 -0.9,0; 2 0.9,0
0603 = smd 1.1 x 1: 1 -0.85,0; 2 0.85,0
0402-CAP = smd 0.7 x 0.9: 1 -0.65,0; 2 0.65,0
LED-0603 = smd 1 x 1: A 0,-0.877; C 0,0.877
USB-MINIB = smd 0.5 x 2.308: D+ 0,4.064; D- -0.8,4.064; GND 1.6,4.064; ID 0.8,4.064; VBUS -1.6,4.064 | smd 2 x 2.4: GND1 -4.4,-2; GND2 -4.4,3.5; GND3 4.4,3.5; GND4 4.4,-2 | hole 1: -2.2,1; 2.2,1
R0402 = smd 0.7 x 0.9: 1 -0.65,0; 2 0.65,0
ML14 = drill 0.914 octagon: 1 -7.62,-1.27; 2 -7.62,1.27; 3 -5.08,-1.27; 4 -5.08,1.27; 5 -2.54,-1.27; 6 -2.54,1.27; 7 0,-1.27; 8 0,1.27; 9 2.54,-1.27; 10 2.54,1.27; 11 5.08,-1.27; 12 5.08,1.27; 13 7.62,-1.27; 14 7.62,1.27
2X10 = drill 1.016 octagon: 1 -11.43,-1.27; 2 -11.43,1.27; 3 -8.89,-1.27; 4 -8.89,1.27; 5 -6.35,-1.27; 6 -6.35,1.27; 7 -3.81,-1.27; 8 -3.81,1.27; 9 -1.27,-1.27; 10 -1.27,1.27; 11 1.27,-1.27; 12 1.27,1.27; 13 3.81,-1.27; 14 3.81,1.27; 15 6.35,-1.27; 16 6.35,1.27; 17 8.89,-1.27; 18 8.89,1.27; 19 11.43,-1.27; 20 11.43,1.27
JST-PH-2-SMT-RA = smd 1 x 4.6: 1 1,-3.7; 2 -1,-3.7 | smd 1.6 x 3.4: NC1 -3.4,1.5; NC2 3.4,1.5
JST-3-PTH-VERT = drill 0.7 pad 1.626: 1 -2,-0.55; 2 0,-0.55; 3 2,-0.55
SDR0403 = drill 0: 1 -1.651,0; 2 1.651,0
MS3V-T1R = smd 0.635 x 1.27: P1 -0.47,-4.43; P2 0.47,-4.43 | smd 1.27 x 2.54: P3 0,1.3
MURATA-FILTER_CSTCR = smd 0.8 x 2.6: 1 -1.5,0; 2 0,0; 3 1.5,0
NX3225 = smd 1.4 x 1.2: 1 -1.1,-0.8; 2 1.1,-0.8; 3 1.1,0.8; 4 -1.1,0.8
SOT23 = smd 1 x 1.4: 1 -0.95,-1.1; 2 0.95,-1.1; 3 0,1.1
0402-RES = smd 0.7 x 0.9: 1 -0.65,0; 2 0.65,0
PBTH = drill 1.016 pad 1.676 octagon: 1 -0.001,0.001; 2 5.001,0.001
AYZ0202 = smd 1 x 1.15: 1 -2.5,2.825; 2 0,2.825; 3 2.5,2.825; 4 -2.5,-2.825; 5 0,-2.825; 6 2.5,-2.825 | hole 0.85: 1.5,0; -1.5,0
SMA-EDGE = smd 1.524 x 4.064: GND@0 0,0; GND@1 5.08,0; SIG 2.54,0 | smd 1.524 x 4.064 bottom: GND@2 0,0; GND@3 5.08,0
QFN-20-0.4MM = smd 0.7 x 0.2: 1 -1.4,0.8; 2 -1.4,0.4; 3 -1.4,0; 4 -1.4,-0.4; 5 -1.4,-0.8; 11 1.4,-0.8; 12 1.4,-0.4; 13 1.4,0; 14 1.4,0.4; 15 1.4,0.8 | smd 0.2 x 0.7: 6 -0.8,-1.4; 7 -0.4,-1.4; 8 0,-1.4; 9 0.4,-1.4; 10 0.8,-1.4; 16 0.8,1.4; 17 0.4,1.4; 18 0,1.4; 19 -0.4,1.4; 20 -0.8,1.4 | smd 1.65 x 1.65: 21 0,0
LGA8 = smd 1.2 x 0.5: 1 -1.2,1.875; 2 -1.2,0.625; 3 -1.2,-0.625; 4 -1.2,-1.875; 5 1.2,-1.875; 6 1.2,-0.625; 7 1.2,0.625; 8 1.2,1.875
PN80 = smd 1.35 x 0.3: 1 -6.825,4.75; 2 -6.825,4.25; 3 -6.825,3.75; 4 -6.825,3.25; 5 -6.825,2.75; 6 -6.825,2.25; 7 -6.825,1.75; 8 -6.825,1.25; 9 -6.825,0.75; 10 -6.825,0.25; 11 -6.825,-0.25; 12 -6.825,-0.75; 13 -6.825,-1.25; 14 -6.825,-1.75; 15 -6.825,-2.25; 16 -6.825,-2.75; 17 -6.825,-3.25; 18 -6.825,-3.75; 19 -6.825,-4.25; 20 -6.825,-4.75; 41 6.825,-4.75; 42 6.825,-4.25; 43 6.825,-3.75; 44 6.825,-3.25; 45 6.825,-2.75; 46 6.825,-2.25; 47 6.825,-1.75; 48 6.825,-1.25; 49 6.825,-0.75; 50 6.825,-0.25; 51 6.825,0.25; 52 6.825,0.75; 53 6.825,1.25; 54 6.825,1.75; 55 6.825,2.25; 56 6.825,2.75; 57 6.825,3.25; 58 6.825,3.75; 59 6.825,4.25; 60 6.825,4.75 | smd 0.3 x 1.35: 21 -4.75,-6.825; 22 -4.25,-6.825; 23 -3.75,-6.825; 24 -3.25,-6.825; 25 -2.75,-6.825; 26 -2.25,-6.825; 27 -1.75,-6.825; 28 -1.25,-6.825; 29 -0.75,-6.825; 30 -0.25,-6.825; 31 0.25,-6.825; 32 0.75,-6.825; 33 1.25,-6.825; 34 1.75,-6.825; 35 2.25,-6.825; 36 2.75,-6.825; 37 3.25,-6.825; 38 3.75,-6.825; 39 4.25,-6.825; 40 4.75,-6.825; 61 4.75,6.825; 62 4.25,6.825; 63 3.75,6.825; 64 3.25,6.825; 65 2.75,6.825; 66 2.25,6.825; 67 1.75,6.825; 68 1.25,6.825; 69 0.75,6.825; 70 0.25,6.825; 71 -0.25,6.825; 72 -0.75,6.825; 73 -1.25,6.825; 74 -1.75,6.825; 75 -2.25,6.825; 76 -2.75,6.825; 77 -3.25,6.825; 78 -3.75,6.825; 79 -4.25,6.825; 80 -4.75,6.825
HTU21D = smd 0.2 x 0.2: 7 0,0 | smd 0.8 x 0.5: DATA 1.5,-1; GND 1.5,0; NC@1 -1.5,1; NC@6 1.5,1; SCK -1.5,-1; VDD -1.5,0
MICRO-SD-SOCKET-PP = smd 0.8 x 1.5: 1 -8.94,10.7; 2 -7.84,10.3; 3 -6.74,10.7; 4 -5.64,10.9; 5 -4.54,10.7; 6 -3.44,10.9; 7 -2.34,10.7; 8 -1.24,10.7 | smd 1.8 x 1.4: CD1 -2.05,0.4; CD2 -7.75,0.4 | smd 1.4 x 1.9: GND1 -13.6,14.55; GND3 -0.45,13.55
VSON40P400X400X12 = smd 0.85 x 0.2: BAT -2,-1; GND 0,0; NC1 -2,-0.2; NC2 1.95,0.6; NC3 1.95,-0.2; PROG 1.95,1; SCL -2,0.6; SDA -2,1; SRN 1.95,-1; SRP 1.95,-0.6; TEST 1.95,0.2; VDD -2,-0.6; VSS -2,0.2
FN-6 = smd 1.05 x 0.3: 1 -0.775,0.65; 2 -0.775,0; 3 -0.775,-0.65; 4 0.775,-0.65; 5 0.775,0; 6 0.775,0.65
RHB32 = smd 0.85 x 0.28: 1 -2.45,1.75; 2 -2.45,1.25; 3 -2.45,0.75; 4 -2.45,0.25; 5 -2.45,-0.25; 6 -2.45,-0.75; 7 -2.45,-1.25; 8 -2.45,-1.75; 17 2.45,-1.75; 18 2.45,-1.25; 19 2.45,-0.75; 20 2.45,-0.25; 21 2.45,0.25; 22 2.45,0.75; 23 2.45,1.25; 24 2.45,1.75 | smd 0.28 x 0.85: 9 -1.75,-2.45; 10 -1.25,-2.45; 11 -0.75,-2.45; 12 -0.25,-2.45; 13 0.25,-2.45; 14 0.75,-2.45; 15 1.25,-2.45; 16 1.75,-2.45; 25 1.75,2.45; 26 1.25,2.45; 27 0.75,2.45; 28 0.25,2.45; 29 -0.25,2.45; 30 -0.75,2.45; 31 -1.25,2.45; 32 -1.75,2.45 | smd 3.45 x 3.45: TP 0,0
SOT95P280X145-6N = smd 1.27 x 0.559: 1 -1.295,0.94; 2 -1.295,0; 3 -1.295,-0.94; 4 1.295,-0.94; 5 1.295,0; 6 1.295,0.94

### Placement (x,y rotation side)
C1  53.19,17.34 180 top
C2  89.9,24.87 0 top
C3  64.2,17.52 180 top
C4  20.73,26.21 180 top
C5  26.21,20.22 0 top
C6  63.43,19.59 180 top
C7  27.14,47.04 0 top
C8  49.03,24.79 270 top
C9  27.07,48.83 0 top
C10  65.59,22.49 180 top
C11  24.02,48.2 90 top
C12  30.02,21.03 270 top
C13  34.29,22.71 90 top
C16  47.45,31.34 180 top
C17  47.45,32.72 180 top
C18  35.36,25.97 180 top
C19  30.74,45.44 90 top
C21  30.99,15.11 90 top
C22  69.49,19.44 270 top
C23  10.19,19.32 180 top
C24  59.11,42.99 0 top
C25  4.57,11.65 180 top
C26  60.1,54.56 180 top
C27  61.67,50.65 270 top
C28  66.22,60.73 90 top
C29  63.46,50.05 270 top
C30  69.14,44.07 270 top
C31  38.51,45.68 90 top
C32  62.46,57.35 90 top
C33  72.57,47.37 270 top
C34  70.09,40.07 180 top
C38  74.28,62.88 90 top
C40  72.28,62.85 90 top
C42  70.18,62.89 90 top
C45  68.07,62.87 90 top
C48  76.3,62.87 90 top
C171  78.66,43.43 90 top
C172  80.95,43.43 90 top
C173  76.5,43.43 90 top
C174  76.5,47.12 270 top
C175  88.19,45.85 270 top
C176  79.93,46.48 0 top
C181  82.98,49.4 270 top
C191  79.63,54.05 0 top
C201  79.68,58.04 0 top
C211  79.68,59.82 0 top
C221  79.59,61.76 180 top
C231  75.03,57.05 0 top
C402  17.68,16.94 180 top
C403  17.11,19.22 0 top
CHARGE  26.97,28.8 270 top
CN1  21.93,4.99 0 top
D8  3.39,17.48 270 top
D9  8.92,11.79 270 top
D10  5.24,14.58 270 top
G1  92.02,31.3 270 top
G2  92.02,34 270 top
G3  92.02,36.7 270 top
J1  58.53,5.07 180 top
J2  94.45,13.43 270 top
J3  4.72,3.66 180 top
JP2  2.52,37.29 90 top
L10  26.21,21.95 180 top
L171  74.22,47.12 270 top
L172  79.93,48.77 0 top
L173  85.52,48.77 0 top
L174  88.19,49.4 90 top
L191  77.01,52.83 90 top
L192  79.68,51.94 0 top
L193  82.98,53.85 270 top
L201  79.68,56.13 0 top
LOGO1  87.22,3.4 0 top
POWER  20.73,28.8 90 top
Q1  59.19,15.94 180 top
Q2  41.31,29.71 90 top
Q3  65.32,57.37 180 top
Q4  8.19,38.38 270 top
Q5  68.12,14.73 270 top
R1  53.12,19.17 180 top
R2  24.76,11.46 0 top
R3  41.1,24.06 180 top
R4  26.01,17.12 0 top
R5  25.98,14.31 0 top
R6  27.13,26.21 180 top
R7  7.66,33.31 0 top
R8  11.13,34.07 270 top
R9  47.73,44.85 90 top
R10  95.62,31.3 180 top
R12  71.93,42.8 270 top
R16  31.85,21.03 90 top
R17  34.14,19.51 270 top
R18  49.93,41.64 90 top
R19  46.46,39.18 270 top
R20  14.86,27.53 0 top
R21  10.64,27.48 180 top
R23  19.23,42.74 90 top
R24  95.62,34 180 top
R25  95.62,36.7 180 top
R26  23.93,26.06 270 top
R27  20.73,31.27 180 top
R171  74.22,43.43 270 top
R181  90.86,50.16 0 top
S1  41.57,3.89 90 top
S2  6.37,28.75 180 top
S3  32.93,5.96 0 top
SMA  96.44,47.62 90 top
U1  21.79,21.95 0 top
U2  23.4,43.94 270 top
U3  58.21,29.61 90 top
U4  34.5,44.32 0 top
U5  74.2,0.7 0 bottom
U6  9.11,15.63 180 top
U7  41.78,44.2 0 top
U8  70.09,52.15 0 top
U11  22.37,15.77 270 top
U$1  2.62,54.04 0 top

### Tracks (layer width: path | path; a pad name or v marks a point on that pad's centre or on a via)
AVCC
  Top 0.203: 54.02,19.42 R1.1
  Top 0.305: U3.11 58.46,21.74 58.02,21.3 54.42,21.3 54.02,20.9 54.02,19.42 | R1.1 53.77,17.4 C1.1
BQ27411_BAT  (via drill 0.33)
  Top 0.203: 3.41,11.91 C25.2 | U6.SRP 6.68,16.23 6.15,16.69 v5,16.69 3.4,16.66 | U6.BAT 11.11,17.39 v10.97,17.53 | 3.86,7.5 J3.1
  Top 0.305: 3.4,16.66 D8.2 3.24,16.69 3.24,12.13 C25.2 | 3.41,11.91 3.41,8.78 3.86,8.33 3.86,7.5
  Bottom 0.203: v10.97,17.53 5.77,17.53 v5,16.69
FLASH_CD  (via drill 0.33)
  Top 0.152: 63.04,29.36 v63.02,29.34
  Top 0.203: U3.30 63.04,29.36
  Bottom 0.152: v63.02,29.34 62.94,29.34 62.87,29.41 | 76.2,0.95 U5.CD1
  Bottom 0.203: 76.2,5.71 76.2,0.95
  Bottom 0.305: 62.87,29.41 62.87,19.05 76.2,5.71
FLASH_CSN  (via drill 0.33)
  Top 0.203: U3.29 81.71,28.86
  Top 0.305: 81.71,28.86 v82.04,28.98
  Bottom 0.152: U5.2 82.01,10.8 81.99,10.82
  Bottom 0.203: 81.99,10.82 v82.04,28.98
FLASH_ENABLE
  Top 0.203: Q5.1 67.02,15.62 arc-45 66.95,15.44 66.27,14.76 62.28,14.76 arc-45 62.1,14.83 61.44,15.49 61.44,22.75 arc-45 U3.17
GND  (via drill 0.33)  (2 unrouted)
  Top 0.203: U6.GND 9.82,15.63 arc-45 10,15.56 10.11,15.44 11.08,15.44 arc-45 U6.VSS | 96.44,54.16 arc-45 v96.44,54.18 | 82.12,44.08 arc45 v82.14,44.09 | 89.33,45.2 arc-45 v89.36,45.19 | 81.62,59.82 arc45 v81.69,59.84 | 81.62,51.94 arc-45 v81.69,51.92 | v61.67,48.75 arc45 v61.67,48.74 | 63.47,48.07 arc-45 v63.45,48.03 | C30.2 68.17,43.42 arc45 v68.15,43.41 | 21.07,21.22 arc45 20.99,21.04 U1.6 arc-45 20.94,20.52 v19.81,20.4 20.32,20.9 arc45 20.39,21.08 U1.5 20.89,21.15 arc45 21.07,21.22 | 21.07,21.22 U1.21 | U1.2 21.29,22.35 | 21.29,22.35 arc-45 21.47,22.27 U1.21 | U1.15 22.5,22.67 arc45 22.52,22.67 U1.21 | U1.19 21.39,22.56 arc-45 21.32,22.38 21.29,22.35 | U3.19 62.46,21.92 arc45 62.53,21.75 63.25,21.03 v63.98,21.03 | 96.44,54.16 arc-45 v96.44,54.18 | SMA.GND@1 95.28,52.7 | 96.44,54.16 arc-45 v96.44,54.18 | 96.44,54.16 arc-45 v96.44,54.18 | U8.TP 70.09,52.11 arc45 v70.1,52.17 | 96.44,46.17 arc45 v96.44,46.15 arc-45 96.44,46.17
  Top 0.305: C172.2 82.12,44.08 | C175.2 89.33,45.2 | C211.2 81.62,59.82 | C201.2 v81.71,58.04 | Q3.2 64.22,59.34 arc45 v64.19,59.41 | C32.2 61.47,58 arc-45 v61.44,58.01 | Q3.4 v67.72,56.57 | v67.72,56.57 arc45 v67.72,56.57 | L192.2 81.62,51.94 | C27.2 v61.67,48.75 | C29.2 63.47,48.07 | R8.1 11.13,36.17 arc45 v11.1,36.25 | JP2.1 4.96,35.29 arc45 v5,35.31 | C23.2 9.34,20.5 arc-45 v9.35,20.52 | U6.GND 9.11,14.12 arc-45 v9.07,14.02 | R27.1 v22.76,31.27 | R26.1 23.93,27.95 arc45 v23.9,28.02 | C4.2 v18.85,26.21 | C18.2 34.51,27.26 arc45 v34.44,27.43 | 33.12,18.77 arc-45 v32.97,18.77 32.98,18.78 arc-45 33.16,18.86 R17.2 | C21.2 32.32,15.96 arc45 v32.49,16.03 | C5.2 v28.52,20.19 | C17.2 45.4,32.72 arc45 v45.34,32.69 | C16.2 45.57,31.34 arc-45 v45.39,31.42 | Q1.P3 60.8,14.64 arc45 v60.83,14.66 | C1.2 51.3,17.34 arc-45 v51.21,17.37 | C8.2 50.1,24.14 arc-45 v50.11,24.13 | C3.- 65.57,19.43 arc45 v65.53,19.53 64.21,19.53 arc-45 C6.1 | C10.1 v66.24,21.42 arc45 v66.24,21.41 | R10.1 96.27,30.44 arc-45 96.19,30.26 v96.11,30.18 | R24.1 96.27,33.28 arc-45 96.19,33.1 v95.91,32.82 | R25.1 96.27,36.05 arc-45 96.19,35.87 v95.91,35.59 | C33.2 72.57,46.1 arc45 72.64,45.92 v73.15,45.41 | C171.2 78.66,44.19 arc45 78.59,44.37 v77.67,45.29 | C28.2 66.22,62.79 arc45 v66.19,62.79 | U3.49 58.96,37.72 arc-45 59.03,37.9 v59.36,38.23 | C13.2 34.16,23.61 arc-45 33.98,23.68 v33.22,24.43 | R2.2 v26.33,11.46 arc-45 v26.34,11.46 | U11.2 22.37,17.09 arc45 22.35,17.14 v22.35,18.31 | Q2.2 39.43,29.71 arc-45 v39.34,29.74 | U7.3 41,42.59 arc-45 v41,42.57 | U7.2 40.22,44.2 arc45 40.04,44.13 v39.85,43.94 | C11.2 22.84,49.05 arc45 v22.71,49 | U2.3 22.77,46.24 arc45 v22.76,46.41
  Top 0.305: C9.2 27.92,49.93 arc45 v27.94,50.22 | C7.2 27.99,46.08 arc-45 v27.99,45.67 | C19.2 30.74,47.46 arc45 v30.73,47.73 | v34.52,46.66 arc45 34.5,46.38 U4.7 U4.GND | C31.2 38.51,47.52 arc45 38.43,47.7 v38.51,47.95 | J3.2 5.72,7.82 arc-45 5.79,8 v6.86,9.07 | D9.2 10.12,11.14 arc45 v10.21,11.18 | C25.1 5.42,10.67 arc45 v5.44,10.44 | D10.2 4.27,13.93 arc-45 v4.24,13.95 | C403.- 15.73,20.61 arc-45 v15.77,20.7 | C402.2 17.03,15.96 arc45 v17.07,15.88 | SMA.GND@0 96.44,46.17 | C22.- 69.49,22.07 arc45 69.42,22.25 v68.83,22.84 | SMA.GND@1 96.44,54.16 arc-45 v96.44,54.18 | U3.68 52.83,30.86 arc-45 v52.88,30.84 | U3.61 arc45 51.34,34.46 v50.52,35.28 | C26.2 v58.06,54.56 | C34.2 68.33,40.07 arc-45 v68.3,40.08 | C45.2 v68.1,64.62 | C42.2 v70.18,64.64 | C40.2 72.28,64.59 arc45 v72.26,64.62 | C38.2 74.28,64.59 arc45 v74.27,64.62 | C48.2 76.33,64.57 arc45 v76.33,64.64 | R12.2 71.93,41.96 arc45 72.01,41.78 v73.81,40.08 | U3.14 59.96,24.86 arc-45 v59.97,24.89 | C2.1 v88.09,24.87 arc45 v88.09,24.87 | C24.2 59.76,43.45 arc-45 59.83,43.63 v60.4,44.2
  Bottom 0.305: U5.GND3 74.65,15.91 arc45 v74.57,16.08 | U5.6 77.64,10.05 arc-45 v77.6,9.96 | U5.GND1 88.63,15.25 arc-45 88.81,15.18 v89.38,14.61
  pour Route2 (isolate 0.203): 0,67 0,0 99,0 99,67
I2C_SCL  (via drill 0.33)
  Top 0.152: 12.48,27.48 12.5,27.5 | 42.55,40.83 42.52,40.82 | 49.89,40.83 R18.1 49.84,40.89
  Top 0.203: U6.SCL 12.29,15.03 12.5,15.24 12.5,27.5 | v60.88,41.76 59.96,40.83 U3.47 arc45 59.94,36.4
  Top 0.305: 12.5,27.5 12.5,30.48 15.92,33.9 15.92,40.6 16.32,40.82 25.22,40.82 | 25.22,40.82 32.82,40.82 | 32.82,40.82 42.52,40.82 | R21.1 12.48,27.48 | U4.SCK 33,40.85 32.82,40.82 | U2.8 25.27,40.85 25.22,40.82 | U7.4 42.55,40.83 49.89,40.83 | 49.84,40.89 49.84,38.18 arc45 49.91,38 54.89,33.02 60.48,33.02 60.68,33.23 arc45 60.76,33.41 60.76,34.16 60.02,34.9 arc-45 59.94,35.08 59.94,36.4
  Bottom 0.152: J2.4 95.72,22.67 | 96.75,38.15 93.12,41.78 | 60.91,41.78 v60.88,41.76
  Bottom 0.203: 95.72,22.67 96.75,23.7 96.75,38.15 | 93.12,41.78 60.91,41.78
I2C_SDA  (via drill 0.33)
  Top 0.152: 13.07,27.53 13.01,27.6 | 36,41.82 v36.02,41.8 | v24.02,41.6 | 43.67,44.85 v43.72,44.9 | R19.1 46.46,39.94 46.52,40 | 60.52,36.37 U3.46 | 62.74,42.55 v63.02,42.55
  Top 0.203: U6.SDA 12.52,14.63 13.01,15.11 13.01,27.6 | U4.DATA 36,41.82 | U2.7 v24.02,41.6 | U7.6 43.67,44.85 | U3.46 60.45,40.26 62.74,42.55 | 60.5,36.32 arc45 U3.46
  Top 0.305: 13.01,27.6 13.01,29.89 16.92,33.8 16.92,39.6 17.32,40 v24.02,40 v36.02,40 v43.82,40 46.52,40 47.07,40 arc-45 47.25,39.93 54.66,32.51 61.14,32.51 61.52,32.9 arc45 61.57,33.07 61.57,34.21 60.58,35.23 arc-45 60.5,35.41 60.5,36.32 | R20.1 13.07,27.53
  Bottom 0.152: 43.72,40.1 v43.82,40 | 97.31,38.28 93.09,42.49 | v63.02,42.55 63.07,42.49
  Bottom 0.203: v36.02,41.8 v36.02,40 | v24.02,41.6 v24.02,40 | v43.72,44.9 43.72,40.1 | J2.6 97.31,21.37 97.31,38.28 | 63.07,42.49 93.09,42.49
IO_LED
  Top 0.203: U3.26 87.2,27.36 G1.A
IO_SCK  (via drill 0.33)
  Top 0.203: U3.36 72.57,32.36 v72.92,32.46
  Bottom 0.152: 78.87,11.07 U5.5
  Bottom 0.203: v72.92,32.46 72.92,11.43 75.89,8.46 77.42,8.46 78.87,9.91
  Bottom 0.305: 78.87,9.91 78.87,11.07
IO_SIMO  (via drill 0.33)
  Top 0.203: U3.40 66.13,34.36 v66.45,34.37
  Bottom 0.152: U5.3 80.94,11.06
  Bottom 0.203: 80.94,11.06 77.65,7.77 75.74,7.77 72.24,11.28 72.24,32.16 70.03,34.37 v66.45,34.37
IO_SOMI  (via drill 0.33)
  Top 0.203: U3.41 62.96,37.18 v63.5,37.72
  Bottom 0.203: U5.7 76.54,34.64 73.46,37.72 v63.5,37.72
JTAG_SENSE
  Top 0.152: 63.57,3.76 J1.4
  Top 0.305: S3.5 32.93,1.98 33.27,1.95 63.27,1.95 63.57,2.25 63.57,3.76
JTAG_VCC  (via drill 0.33)
  Top 0.152: S3.3 35.4,8.87 | 37.08,5.99 37.03,5.99 v37.13,5.92
  Top 0.305: S3.3 35.43,7.65 37.08,5.99
  Bottom 0.152: 66.27,3.68 J1.2
  Bottom 0.305: v37.13,5.92 37.11,2.46 37.64,1.91 65.96,1.91 66.27,2.21 66.27,3.68
LIGHT_INT
  Top 0.152: 47.52,44.2 R9.1 47.79,44.27
  Top 0.203: U7.5 47.52,44.2 | U3.58 54.46,40.87 51.05,44.27 47.79,44.27
MOTION_ENABLE  (via drill 0.33)
  Top 0.152: 53.52,38.1 v53.55,38.1 | 7.13,39.37 Q4.1
  Top 0.305: U3.59 53.96,37.66 53.52,38.1 | v11.2,39.37 7.13,39.37
  Bottom 0.305: v53.55,38.1 12.46,38.1 v11.2,39.37
MOTION_INT  (via drill 0.33)
  Top 0.152: U3.60 53.46,36.64 | 52.76,37.34 v52.71,37.34
  Top 0.305: 53.46,36.64 52.76,37.34
  Bottom 0.203: 52.66,37.29 v52.71,37.34
  Bottom 0.305: JP2.2 52.66,37.29
N$1
  Top 0.152: U2.2
  Top 0.305: C11.1 U2.2
N$3
  Top 0.305: Q4.2 4.92,37.43 JP2.3
N$4
  Top 0.152: U8.17 72.59,50.4 | 74.09,47.89 L171.1
  Top 0.305: 72.59,50.4 74.09,48.9 74.09,47.89 | L171.1 C174.1
N$7  (via drill 0.33)
  Top 0.305: v77.75,13.34 76.19,11.78 arc-45 76.01,11.7 arc45 76,11.71 75.18,11.71 | Q5.2 67.02,12.13 arc45 67.1,11.95 67.33,11.71 75.18,11.71 | v75.44,10.06 75.44,11.35 arc45 75.36,11.53 75.18,11.71
  Bottom 0.203: 79.83,11.61 arc45 U5.4
  Bottom 0.305: v77.75,13.34 79.42,13.34 arc-45 79.6,13.26 79.83,13.03 79.83,11.61 | U5.8 v75.44,10.06 arc45 v75.44,10.06
N$9
  Top 0.152: C231.2 75.74,56.99
  Top 0.305: 75.74,56.99 75.74,56.08 73.06,53.4 U8.23
N$10  (via drill 0.33)
  Top 0.152: 21.95,9.05 CN1.D+ | 21.93,11.64 v21.89,11.68 | 21.39,17.02 U11.3
  Top 0.203: CN1.D+ 21.93,11.64 | v21.89,15.75 21.77,15.75 21.39,16.13 21.39,17.02
  Bottom 0.203: v21.89,11.68 v21.89,15.75
N$11
  Top 0.152: 11.31,19.05 C23.1
  Top 0.203: U6.VDD 11.84,16.23 12.12,16.51 12.12,18.8 11.86,19.05 11.31,19.05
N$12
  Top 0.152: U6.TEST 7.11,15.41 5.29,15.41 D10.1
N$13
  Top 0.305: U8.24 74.38,55.74 C231.1
N$14  (via drill 0.33)
  Top 0.152: v21.13,11.05
  Top 0.203: CN1.D- v21.13,11.05 | U11.4 21.43,13.76 v21.13,13.34
  Bottom 0.203: v21.13,11.05 v21.13,13.34
N$15
  Top 0.152: U6.PROG
  Top 0.203: D9.1 7.42,12.44 7.16,12.7 U6.PROG
N$16
  Top 0.152: C211.1 78.66,59.82
  Top 0.305: 78.66,59.82 77.65,58.8 77.65,56.01 74.04,52.4 U8.21
N$17
  Top 0.152: 79.27,46.47 C176.1
  Top 0.305: C174.2 79.27,46.47 | L172.1 C176.1
N$18
  Top 0.152: C29.1 63.74,50.98 63.25,50.98
  Top 0.305: U8.6 64.26,51.4 arc45 64.08,51.32 C29.1
N$20
  Top 0.152: 82.97,48.77 C181.2 83,48.77
  Top 0.305: C176.2 L172.2 82.97,48.77 | 83,48.77 L173.1
N$22
  Top 0.152: L174.2 88.3,50.16
  Top 0.305: 88.3,50.16 R181.1
N$23
  Top 0.305: U8.18 82.14,50.9 C181.1 L193.2
N$24
  Top 0.152: 72.6,52.83 U8.22
  Top 0.305: C221.2 76.89,59.7 76.89,56.24 73.55,52.9 U8.22
N$25
  Top 0.305: SMA.SIG R181.2
N$26
  Top 0.152: L173.2 86.19,48.75
  Top 0.305: 86.19,48.75 L174.1 C175.1
N$27
  Top 0.203: CN1.GND 23.53,10.88 R2.1
N$28
  Top 0.305: L171.2 R171.1 C173.2
N$30
  Top 0.152: Q3.1 67.03,58.34 | U8.30 | 66.42,59.92 C28.1
  Top 0.203: 69.27,56.49 69.24,56.52
  Top 0.305: 67.03,58.34 69.24,56.52 | Q3.1 66.42,59.92 | U8.30 69.34,56.31 arc45 69.27,56.49
N$31
  Top 0.152: 78.92,52.18 L192.1 | 79.11,51.99 L192.1 | 78.98,51.99 L192.1
  Top 0.305: U8.19 76.35,51.4 L191.1 78.92,52.18 | C191.1 78.98,51.99
N$32
  Top 0.305: C201.1 L201.1 78.66,56.13 77.01,54.48 L191.2 75.43,51.9 U8.20
N$33
  Top 0.152: U8.31 68.84,54.91 | 62.59,56.57 C32.1
  Top 0.305: 68.84,54.91 68.56,55.5 65.59,55.5 Q3.3 62.59,56.57
N$34
  Top 0.305: G1.C R10.2
N$35
  Top 0.152: 80.33,54.13 C191.2
  Top 0.305: L201.2 80.33,54.13 | C191.2 82.53,54.05 L193.1
N$36
  Top 0.203: U1.13 L10.2
N$37  (via drill 0.33)
  Top 0.305: v72.92,43.46 arc-45 72.9,43.45 R12.1 arc-45 71.88,43.57 71.88,45.09 70.91,46.06 arc-45 70.84,46.23 U8.14
N$38
  Top 0.152: 7.28,33.27 R7.1
  Top 0.203: 7.28,33.27 2.31,33.27 1.37,32.34 S2.2
N$39
  Top 0.305: R24.2 G2.C
N$41
  Top 0.305: G3.C R25.2
N$42
  Top 0.152: 23.48,14.31 U11.6
  Top 0.203: R5.1 23.48,14.31
N$43
  Top 0.152: 25.3,17.07 R4.1
  Top 0.203: U11.1 25.3,17.07
N$44
  Top 0.152: 27.78,28.73 CHARGE.C
  Top 0.203: R6.1 27.78,28.73
N$45  (via drill 0.33)
  Top 0.152: 21.6,26.24 C4.1 | U1.12 23.59,21.55
  Top 0.203: U1.12 24.34,21.55 C5.1 | CHARGE.A POWER.A 21.6,26.24 | C4.1 21.63,24.09 | 21.63,24.09 21.79,23.93 U1.18 | v19.28,24.64 21.08,24.64 21.63,24.09 | v24.11,20.19 C5.1 | 25.55,20.22 C5.1
  Bottom 0.203: v19.28,24.64 19.1,24.46 19.07,19.13 19.36,18.92 23.88,18.92 24.11,19.15 v24.11,20.19
N$46
  Top 0.152: 23.25,22.4 U1.14
  Top 0.203: R6.2 26.48,24.8 24,22.33 23.21,22.33 U1.14
N$47
  Top 0.152: 19.85,31.04 R27.2
  Top 0.203: POWER.C 19.85,31.04
N$49
  Top 0.152: 32.12,20.12 R16.1 32.08,20.16 | 29.82,20.38 C12.2
  Top 0.203: U1.8 21.79,19.36 22.05,19.02 28.74,19.02 C12.2
  Top 0.305: R16.1 29.82,20.38 | R17.1 32.08,20.16
N$50
  Top 0.203: R26.2 23.93,24.68 U1.16
P1.0
  Top 0.203: U3.21 68.26,24.86 78.94,14.17 78.94,10.67 86.33,3.28 94.44,3.28 J2.20
P1.1
  Top 0.152: 93.15,4.57 J2.17
  Top 0.203: U3.22 69.05,25.36 80.01,14.4 80.01,11.28 86.72,4.57 93.15,4.57
P1.2
  Top 0.203: U3.23 69.77,25.86 81.31,14.33 81.31,11.89 87.4,5.79 94.47,5.79 J2.18
P1.3
  Top 0.152: J2.15
  Top 0.203: U3.24 70.49,26.36 82.6,14.25 82.6,12.72 88.24,7.09 J2.15
P1.4
  Top 0.203: U3.25 71.44,26.86 84.12,14.17 84.12,13.87 89.61,8.38 94.42,8.38 J2.16
P2.2  (via drill 0.33)
  Top 0.203: U3.31 82.69,29.86 v83.06,29.41
  Bottom 0.152: 93.08,9.53 J2.13
  Bottom 0.203: v83.06,29.41 83.06,16.92 90.45,9.53 93.08,9.53
P2.3  (via drill 0.33)
  Top 0.152: v85.9,15.34 85.93,15.34
  Top 0.203: U3.32 83.33,30.36 v83.87,29.82 | 85.93,15.34 90.35,10.92 94.42,10.92 J2.14
  Bottom 0.203: v83.87,29.82 83.87,17.37 v85.9,15.34
P2.4  (via drill 0.33)
  Top 0.152: v84.61,18.52 84.61,18.36 | J2.11
  Top 0.203: U3.33 84.05,30.86 v84.61,30.3 | 84.61,18.36 90.81,12.17 J2.11
  Bottom 0.203: v84.61,30.3 v84.61,18.52
P2.5  (via drill 0.33)
  Top 0.203: U3.34 84.87,31.36 v85.39,30.84
  Bottom 0.203: J2.12 94.47,13.41 92,13.39 85.37,19.86 v85.39,30.84
P2.6  (via drill 0.33)
  Top 0.203: U3.35 85.8,31.86 v86.26,31.39
  Bottom 0.152: J2.9
  Bottom 0.203: J2.9 92.13,14.71 86.26,20.57 v86.26,31.39
P5.2/XT2IN
  Top 0.152: 51.37,30.35 U3.69
  Top 0.203: Q2.3 42.91,31.21 43.77,30.35 51.37,30.35
P5.3/XT2OUT
  Top 0.152: 42.07,28.15 41.37,28.15 Q2.1
  Top 0.203: U3.70 43.78,29.86 42.07,28.15
P5.4/XIN
  Top 0.152: 58.96,20.32 Q1.P2
  Top 0.305: U3.12 58.96,20.32
P5.5/XOUT
  Top 0.152: 59.46,20.27 Q1.P1
  Top 0.305: U3.13 59.46,20.27
PRESSURE_INT  (via drill 0.33)
  Top 0.152: v22.77,41.64 v22.78,41.63
  Top 0.203: U2.6 v22.77,41.64 | U3.43 61.96,38.83 v61.62,38.96
  Top 0.305: v17.96,42.09 19.15,42.09 arc-45 19.15,42.09 R23.1 19.73,42.09 arc-45 19.91,42.02 20.24,41.68 22.66,41.68 arc-45 v22.78,41.63
  Bottom 0.203: v22.78,41.63 22.78,39.34 23.19,38.94 v61.62,38.96
REGULATOR_BUCK_ON  (via drill 0.33)
  Top 0.152: U1.7 21.39,20.46 21.39,19.81
  Top 0.203: U3.2 53.96,21.8 53.49,21.34 v42.29,21.34 | 21.39,19.81 v21.16,19.61
  Bottom 0.203: v42.29,21.34 23.01,21.34 v21.16,19.61
REGULATOR_HPWR  (via drill 0.33)
  Top 0.152: 53.38,22.71 U3.1
  Top 0.203: v42.29,22.71 53.38,22.71 | U1.1 20.51,22.75 20.55,22.71 20.37,22.71 v19.79,23.29
  Bottom 0.203: v42.29,22.71 20.37,22.71 v19.79,23.29
REGULATOR_VCC  (via drill 0.33)
  Top 0.152: S3.1 30.36,8.86 30.8,8.86 | 27.86,21.93 L10.1 | 31.98,21.81 R16.2 | 29.82,21.68 C12.1 | 34.3,21.79 C13.1 34.38,21.72 | 30.36,10.37 v30.4,10.41
  Top 0.305: S3.1 S3.4 | C12.1 27.86,21.93 | C13.1 31.98,21.81 | R16.2 29.82,21.68 | 30.36,8.86 30.36,10.37 | v35.66,20.17 35.66,21.08 35.1,21.72 34.38,21.72
  Bottom 0.305: v30.4,10.41 35.66,15.75 v35.66,20.17
RF_CLK
  Top 0.152: 64.98,33.91 U3.39
  Top 0.203: U8.8 66.55,50.4 64.92,48.77 64.92,36.42 62.87,34.37 62.87,34.06 63.02,33.91 64.98,33.91
RF_CSN  (via drill 0.33)
  Top 0.152: 56.92,36.47 U3.53
  Top 0.203: U8.11 69.34,46.7 v68.96,46.33 | 57.38,45.16 56.92,44.7 56.92,36.47
  Top 0.305: v57.38,45.26 57.38,45.16
  Bottom 0.203: v68.96,46.33 68.96,45.92 68.68,45.57 57.76,45.57 v57.38,45.26
RF_GPIO0  (via drill 0.33)
  Top 0.152: 68.89,49.65 U8.10 | 68.25,47.07 v68.22,47.04
  Top 0.203: 56.46,39.77 U3.54 56.46,45.7 56.9,46.13 v56.92,46.13 | 68.89,49.65 68.89,48.26 68.25,47.62 68.25,47.07
  Bottom 0.152: 56.87,46.1 56.9,46.1 v56.92,46.13
  Bottom 0.203: v68.22,47.04 68.22,46.61 67.72,46.1 56.87,46.1
RF_GPIO2
  Top 0.152: 55.93,36.46 U3.55
  Top 0.305: U8.4 56.2,52.4 55.93,52.12 55.93,36.46
RF_GPIO3
  Top 0.152: 55.47,36.45 U3.56
  Top 0.305: U8.3 55.71,52.9 55.47,52.65 55.47,36.45
RF_LED
  Top 0.152: 89.71,33.86 89.71,35.27 G3.A
  Top 0.203: U3.28 84.21,28.36 89.71,33.86
RF_RESET
  Top 0.152: 67.62,53.42 U8.2
  Top 0.305: U3.57 54.96,52.98 55.4,53.42 67.62,53.42
RF_SIMO
  Top 0.152: 65.02,32.84 U3.37
  Top 0.203: U8.7 66.14,50.9 64.31,49.07 64.31,36.58 62.1,34.34 62.1,33.3 62.48,32.84 65.02,32.84
RF_SOMI
  Top 0.152: 65.09,33.3 U3.38
  Top 0.203: 65.09,33.3 66.37,33.3 67.31,34.29 67.31,47.65 68.34,48.63 U8.9
RST/SBWTDIO
  Top 0.152: 51.37,26.85 U3.76
  Top 0.203: 46.38,24.05 arc45 46.37,24.06 | R3.1 41.64,23.95 arc45 41.57,23.77 | 41.64,7.61 arc-45 41.57,7.79
  Top 0.305: 51.37,26.85 50.54,26.85 arc45 50.36,26.77 C8.1 47.87,25.44 arc45 47.69,25.36 46.38,24.05 | 46.37,24.06 R3.1 | 41.57,23.77 S1.2 41.57,7.79 | J1.11 51.98,4.88 arc-45 51.81,4.8 44.45,4.8 41.64,7.61
SENSOR_LED
  Top 0.203: U3.27 85,27.86 G2.A
TARGET_PUR  (via drill 0.33)
  Top 0.152: 51.37,33.38 U3.63 51.43,33.4 | 11.12,33.3 R8.2
  Top 0.203: R7.2 11.12,33.3 | R8.2 12.73,33.42 v12.65,33.4 | v52.73,33.4 51.43,33.4
  Bottom 0.203: v12.65,33.4 v52.73,33.4
TARGET_VUSB
  Top 0.203: U3.66
  Top 0.305: C17.1 48.82,32.72 49.68,31.85 U3.66
TCK  (via drill 0.33)
  Top 0.152: 51.37,27.35 U3.75
  Top 0.203: U3.75 arc45 U3.75
  Top 0.305: U3.75 48.41,27.36 arc45 48.23,27.28 v45.97,24.89
  Bottom 0.305: J1.7 58.53,8.59 57.67,9.45 46.37,9.45 45.97,9.85 v45.97,24.89
TDI  (via drill 0.33)
  Top 0.305: U3.73 52.56,28.36 arc-45 52.74,28.28 v53.11,27.91
  Bottom 0.305: J1.3 63.61,10.41 62.57,11.45 53.7,11.45 53.19,11.96 arc-45 53.11,12.14 v53.11,27.91
TDO  (via drill 0.33)
  Top 0.305: U3.72 53.66,28.86 arc-45 53.84,28.78 v54.28,28.35
  Bottom 0.305: J1.1 66.15,11.37 64.97,12.55 55.12,12.55 54.35,13.31 arc-45 54.28,13.49 v54.28,28.35
TEST/SBWTCK  (via drill 0.33)
  Top 0.203: 45.13,29.36 arc45 44.95,29.28
  Top 0.305: U3.71 45.13,29.36 | 44.95,29.28 v44.76,29.08
  Bottom 0.152: J1.8 58.32,3.8
  Bottom 0.203: 44.76,8.48 arc45 44.77,8.45
  Bottom 0.305: 58.32,3.8 57.37,4.75 57.37,7.65 56.97,8.05 45.17,8.05 44.77,8.45 | v44.76,29.08 44.76,8.48
TMS  (via drill 0.33)
  Top 0.152: 51.37,27.85 U3.74
  Top 0.203: 48.16,27.86 arc45 47.98,27.78
  Top 0.305: U3.74 48.16,27.86 | 47.98,27.78 v47.02,27
  Bottom 0.203: 47.09,10.93 47.07,10.95
  Bottom 0.305: J1.5 61.07,9.75 60.17,10.65 47.37,10.65 47.09,10.93 arc-45 47.02,11.11 v47.02,27
UCA1_CLK  (via drill 0.33)
  Top 0.152: U3.45 61.01,36.48 | 62.28,41.02 v62.28,41.05 | v93.09,40.97 93.12,41 95.73,41 97.77,38.96 | 96.01,14.7 J2.10
  Top 0.203: 61.01,36.48 61.01,39.75 62.28,41.02 | 97.77,38.96 97.77,16.46 96.01,14.7
  Bottom 0.152: v62.28,41.05 62.36,40.97
  Bottom 0.203: 62.36,40.97 v93.09,40.97
UCA1_RXD  (via drill 0.33)
  Top 0.203: v57.43,33.68 arc45 57.46,33.75 U3.52
  Bottom 0.152: J2.3
  Bottom 0.203: J2.3 90.37,22.33 88.77,23.93 88.77,29.79 79.7,38.86 63.32,38.86 58.22,33.76 arc-45 58.03,33.68 v57.43,33.68
UCA1_STE  (via drill 0.33)
  Top 0.203: v74.24,26.72 93.8,26.72 94.49,26.14 94.49,18.47 J2.8 | U3.48 59.46,34.55 arc45 59.53,34.37 v59.89,34.01
  Bottom 0.203: 74.27,32.08 71.47,34.88 arc45 71.29,35 60.99,35 arc45 60.81,34.93 v59.89,34.01
  Bottom 0.305: 74.27,32.08 v74.24,26.72
UCA1_TXD  (via drill 0.33)
  Top 0.203: U3.51 57.96,35.31 arc45 58.03,35.13 v58.29,34.87
  Bottom 0.152: 61.92,38.28 61.95,38.25
  Bottom 0.203: 63.08,39.38 61.95,38.25 58.65,34.95 arc-45 58.47,34.87 v58.29,34.87 | J2.5 93.62,19.78 94.56,20.73 94.56,22.76 93.7,23.62 90.32,23.62 90.04,23.9 90.04,29.82 80.39,39.47 63.17,39.47
  Bottom 0.305: 63.17,39.47 63.08,39.38
USB_DM
  Top 0.152: 51.37,32.85 U3.64 | 51.32,32.92 U3.64 | 51.29,32.77 U3.64 | R5.2 26.63,14.26 26.59,14.22 | C21.1 31.02,14.22
  Top 0.203: 51.29,32.77 50.6,32.77 49.23,34.14 37.95,34.14 37.41,33.6 37.41,17.04 34.59,14.22 31.02,14.22 26.59,14.22
USB_DP
  Top 0.152: 51.37,33.85 U3.62 51.36,33.83 | C18.1 36.3,25.97 36.37,25.9
  Top 0.203: 51.36,33.83 50.44,33.83 49.55,34.72 37.44,34.72 36.37,33.66 36.37,25.9 36.37,18.67 34.82,17.12 R4.2
USB_VBUS  (via drill 0.33)
  Top 0.152: 51.37,32.35 U3.65 51.33,32.31 | 20.31,9.06 CN1.VBUS 20.27,8.99 20.3,8.97 | 20.33,11.21 20.33,11.39 | 22.28,14.38 U11.5 | 18.47,16.89 18.47,16.8 C402.1 18.38,16.89 18.47,16.89 | 18.59,16.89 18.47,16.89 | C403.+ 18.47,19.2 | 18.47,24 18.47,23.98
  Top 0.203: 51.33,32.31 50.29,32.31 48.92,33.58 38.71,33.58 38.25,33.22 38.25,15.72 35.48,12.95 21.89,12.95 | CN1.VBUS 20.33,11.21 18.47,13.08 18.47,16.8 | 20.33,11.39 21.89,12.95 | 21.89,12.95 22.28,13.34 22.28,14.38 | U1.20 20.34,24 18.47,24 | 18.47,23.98 v18.47,23.95 18.47,19.2 18.47,16.89 | J2.19 73.4,2 72.39,0.99 22.25,0.99 21.89,1.35 21.89,5.64 20.3,7.24 20.3,8.97 | S2.1 6.37,26.01 v8.38,24.05
  Bottom 0.203: v8.38,24.05 18.34,24.05 v18.47,23.95
V18
  Top 0.203: 51.37,31.34 U3.67
  Top 0.305: C16.1 51.37,31.34
VBAT+  (via drill 0.33)
  Top 0.152: 3.35,18.17 D8.1
  Top 0.203: D8.1 5.66,18.13 U6.SRN | U1.17 22.19,24.55 v22.53,24.89 | v3.35,20.83 3.35,18.17
  Bottom 0.152: v22.53,24.89 22.53,25.15 22.4,25.27
  Bottom 0.203: 22.4,25.27 7.8,25.27 v3.35,20.83
VCC  (via drill 0.33)
  Top 0.203: U2.1 25.27,44.95 | U3.18 61.96,20.41 C6.2 62.78,17.56
  Top 0.305: C172.1 C171.1 C173.1 R171.2 74.22,41.46 arc45 74.29,41.28 v75.46,40.11 | U8.12 69.84,45.42 C30.1 68.07,44.72 arc-45 v68.05,44.73 | C9.1 26.22,47.1 C7.1 26.29,46.15 U2.1 | 25.27,44.95 24.32,44 22.22,44 21.62,44.6 21.62,45.05 | 21.62,45.05 U2.4 | U7.1 40.99,44.83 C31.1 v38.51,43.18 arc45 v38.51,43.18 | U4.VDD 32.73,44.59 C19.1 30.74,43.33 arc-45 v30.71,43.26 | 62.78,17.56 C3.+ 62.82,16.2 arc45 v62.87,16.1 | Q5.3 69.42,14.92 arc45 69.49,15.1 C22.+ v71.09,18.06 arc-45 v71.09,18.06 | R1.2 51.23,19.17 arc-45 v51.21,19.18 | R3.2 40.45,25.2 arc-45 v40.46,25.22 | S3.2 arc45 32.88,8.9 32.87,8.91 32.87,10.21 arc-45 v32.94,10.39 | R9.2 47.73,47.08 arc-45 v47.75,47.14 | R18.2 v48.44,42.29 arc45 v48.44,42.29 | C221.1 81.53,61.76 arc45 v81.69,61.82 | R21.2 9.99,28.68 arc45 v9.98,28.7 | R20.2 15.51,28.7 arc-45 v15.52,28.73 | Q4.3 9.29,36.32 arc45 v9.32,36.25 | R23.2 18.04,43.39 arc-45 v17.93,43.43 | 21.62,45.05 v21.62,46.42 arc45 v21.61,46.43 | R19.2 46.46,36.73 arc-45 v46.43,36.45 | v60.58,55.85 60.67,55.76 arc-45 60.75,55.58 C26.1 61.34,53.97 arc45 61.52,53.9 U8.1 | v60.6,51.26 60.72,51.38 arc45 60.89,51.3 C27.1 62.19,51.82 arc-45 62.37,51.9 U8.5 | U8.25 72.03,54.79 arc-45 72.21,54.86 72.69,54.86 73.43,55.6 arc45 73.51,55.78 73.51,57.61 76.25,60.38 arc45 76.33,60.56 C48.1 77.2,62.19 arc45 v77.32,62.2 | C38.1 74.49,62.23 arc45 74.5,62.23 | C38.1 v75.29,62.23 | v73.25,62.23 arc45 73.27,62.26 72.31,62.26 72.34,62.23 arc-45 C40.1 72.19,62.11 arc45 72.11,61.93 72.11,57.23 70.91,56.03 arc45 70.84,55.85 U8.27 | v71.17,62.18 arc136 71.19,62.22 C42.1 70.26,62.16 arc-45 70.34,61.98 U8.28
  Top 0.305: v69.11,62.2 arc45 69.06,62.2 C45.1 arc45 68.02,62.09 68.02,60.17 69.76,58.43 arc-45 69.84,58.25 U8.29 | U8.26 71.34,55.18 arc-45 71.41,55.36 72.85,56.79 72.85,58.37 arc-45 72.92,58.55 74.27,59.89 74.27,62.2 arc-45 C38.1 | v72.08,40.08 arc-45 72.05,40.07 C34.1 70.41,40.4 arc-45 70.34,40.58 U8.13 | v71.53,48.01 arc-45 71.56,48.02 C33.1 71.41,49.18 arc-45 71.34,49.36 U8.15 | C2.2 90.55,25.7 arc-45 90.62,25.88 v90.7,25.96 | J2.1 90.52,24.86 arc-45 90.5,24.87 | v58.75,44.3 58.53,44.08 arc45 58.46,43.9 C24.1 U3.50
  pour Route15 (isolate 0.203): 0,67 0,0 99,0 99,67
VCORE
  Top 0.305: C10.2 63.26,22.48 U3.20